# EAGLE board Driver_Board_Niall (EAGLE 9.1.3), part 1 of 2
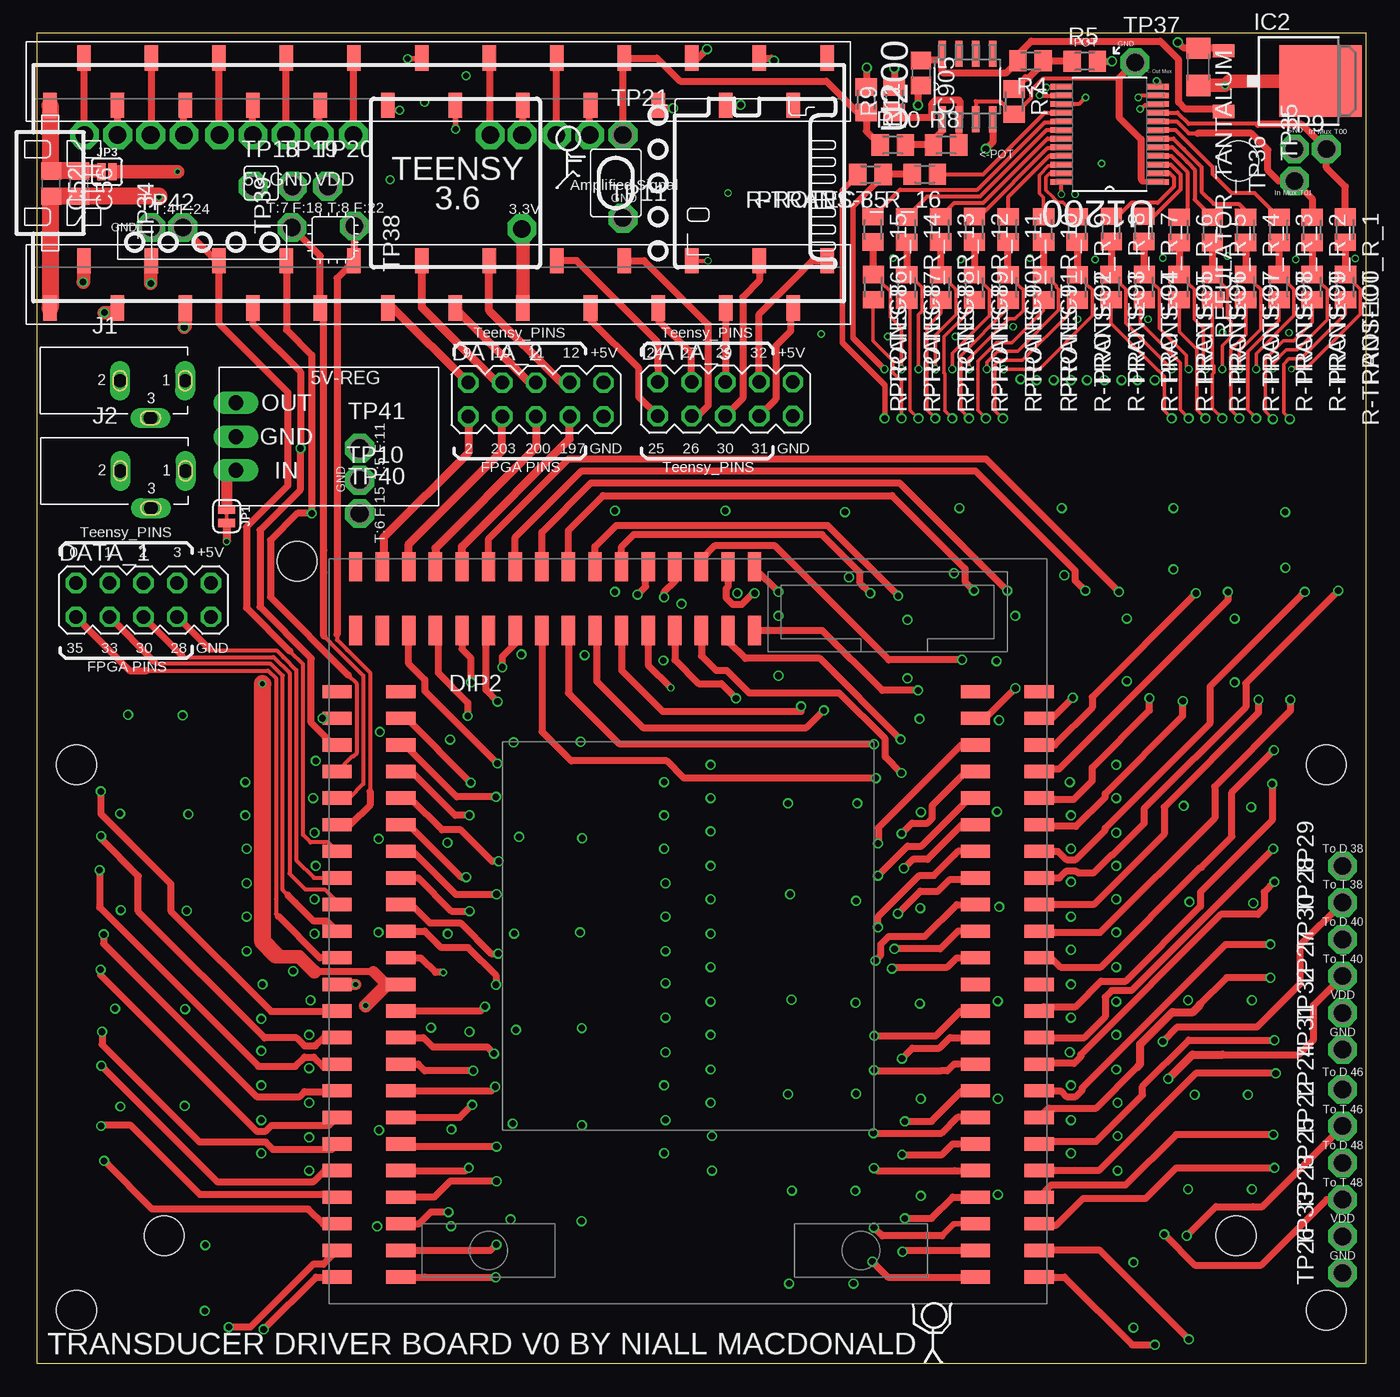
[diagram p5: board, top side]
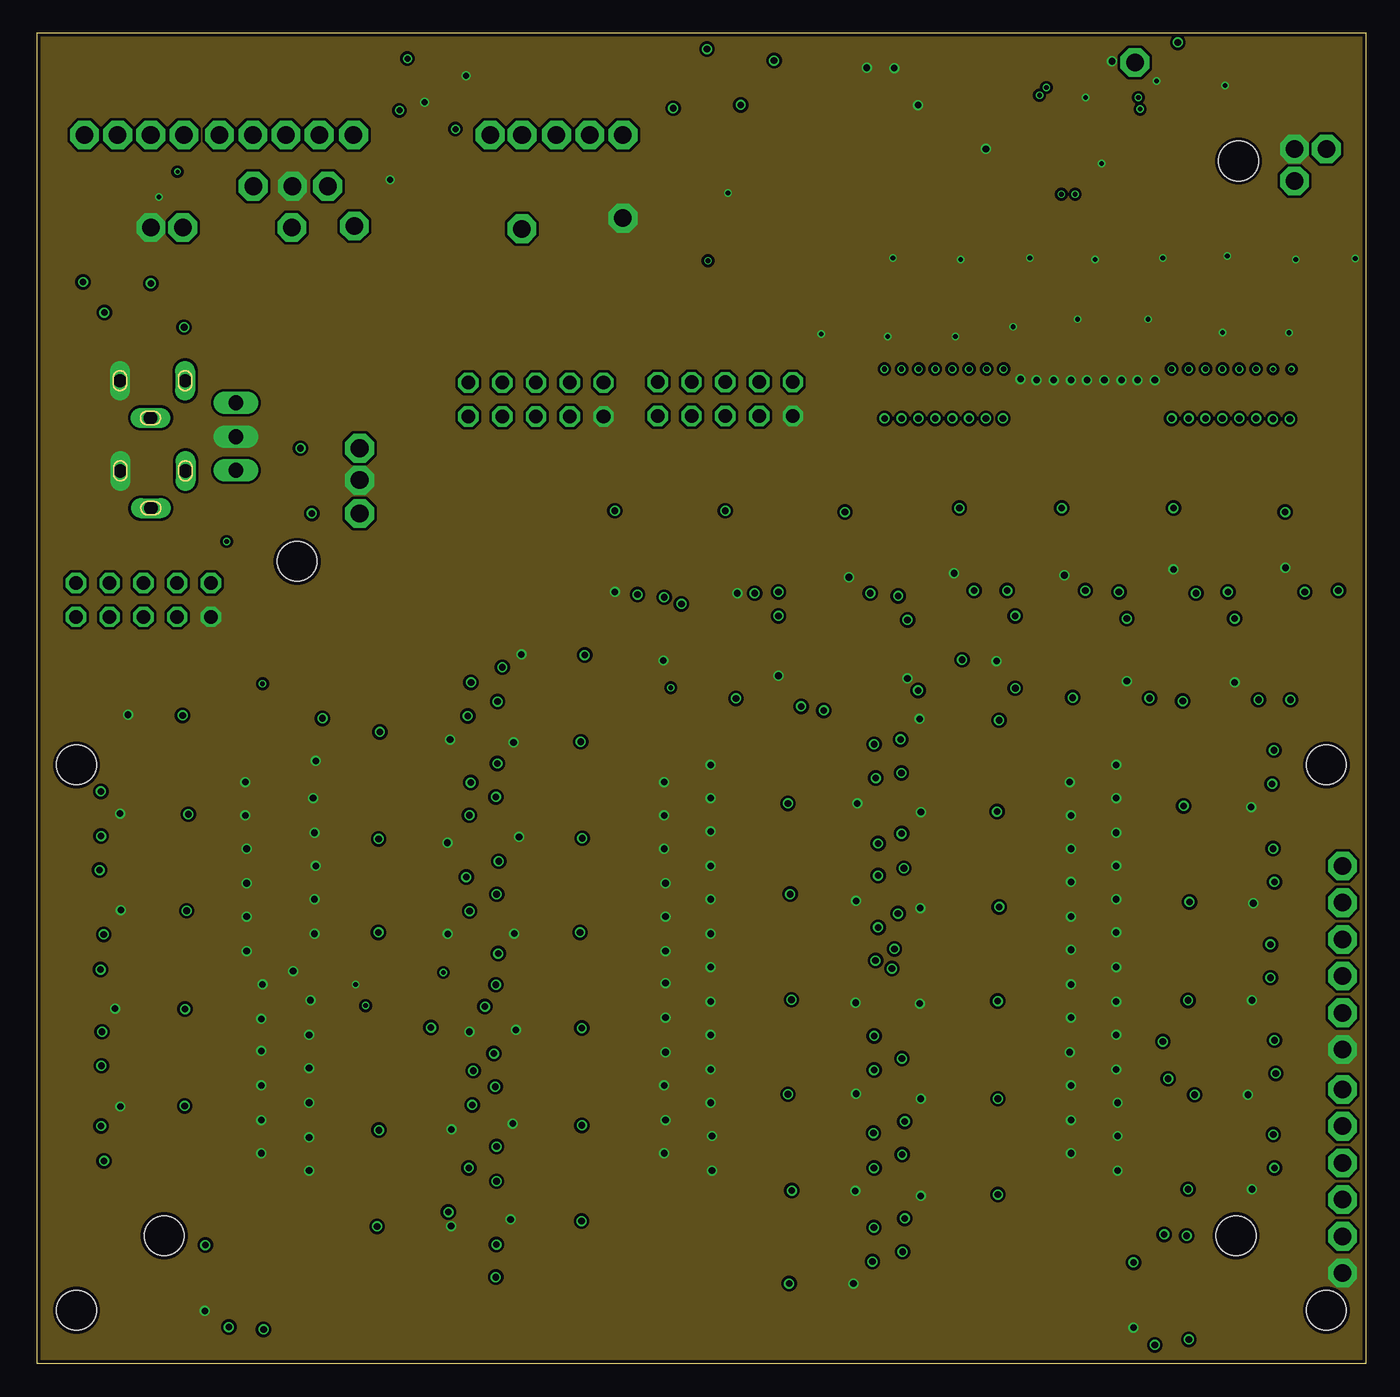
[diagram p6: board, inner layer $GND]
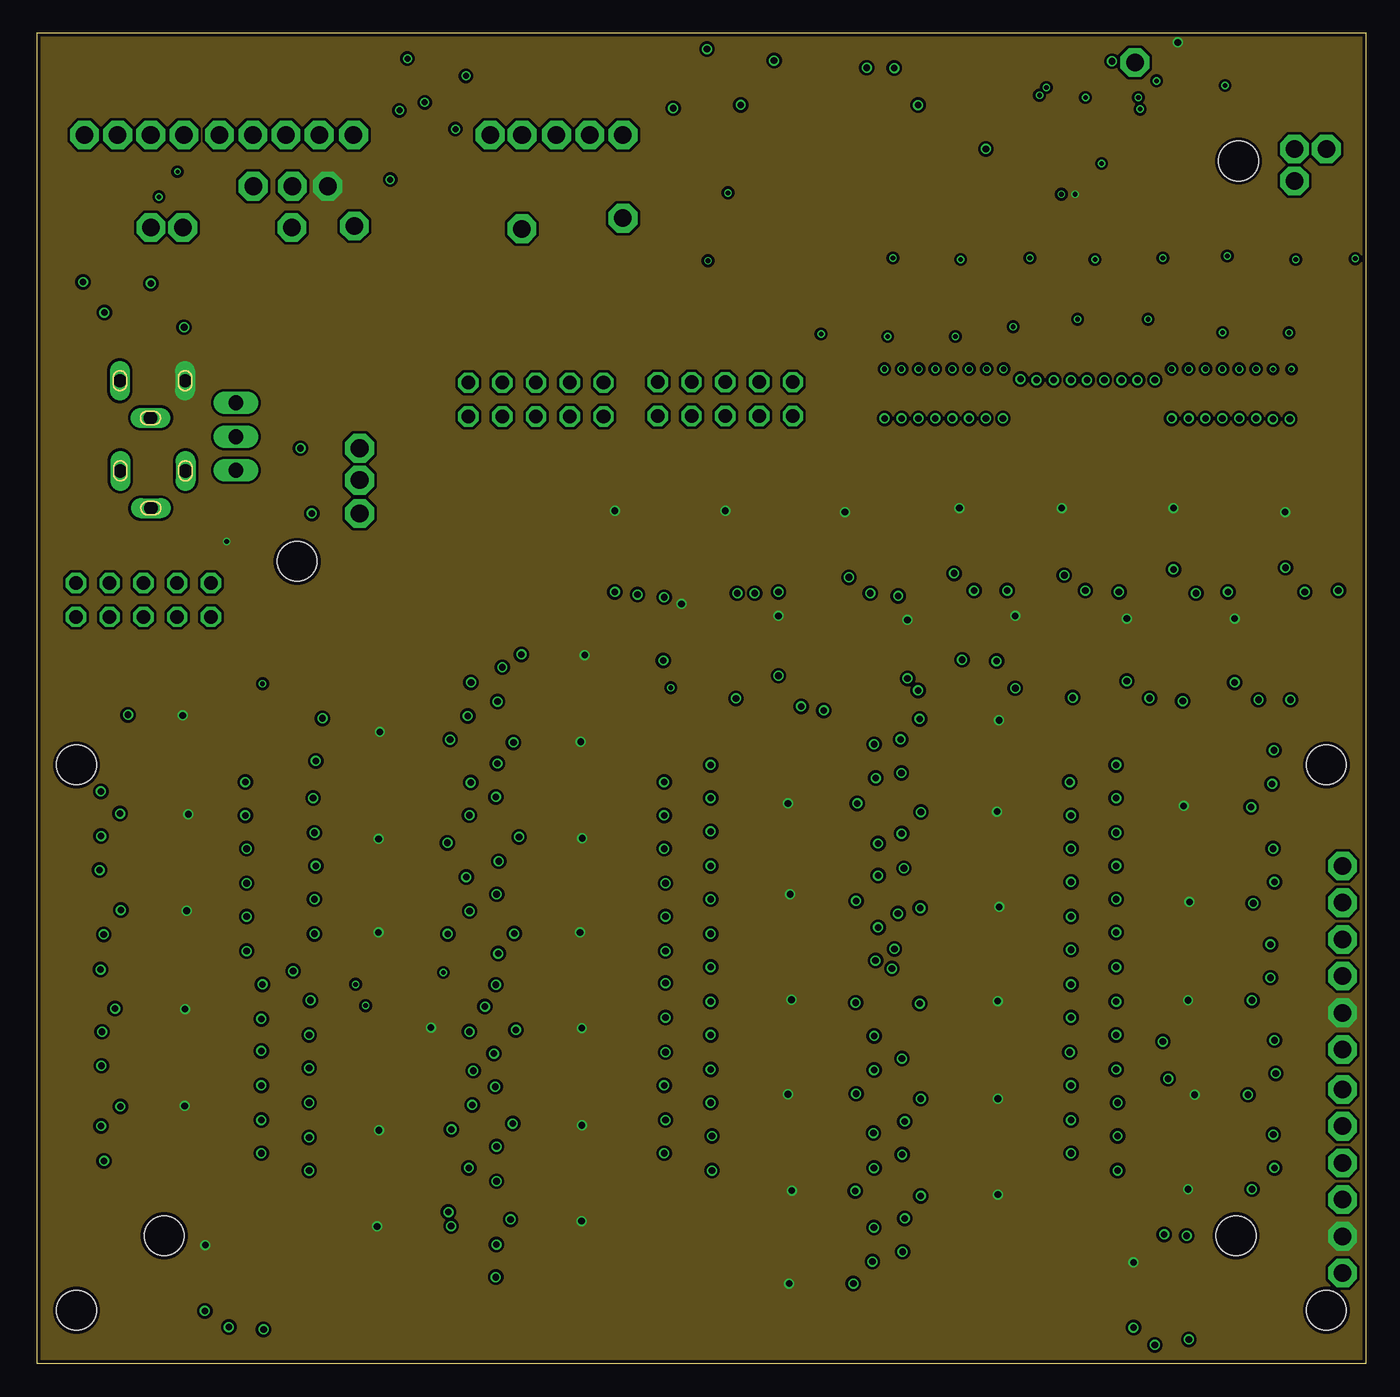
[diagram p7: board, inner layer $VIN]
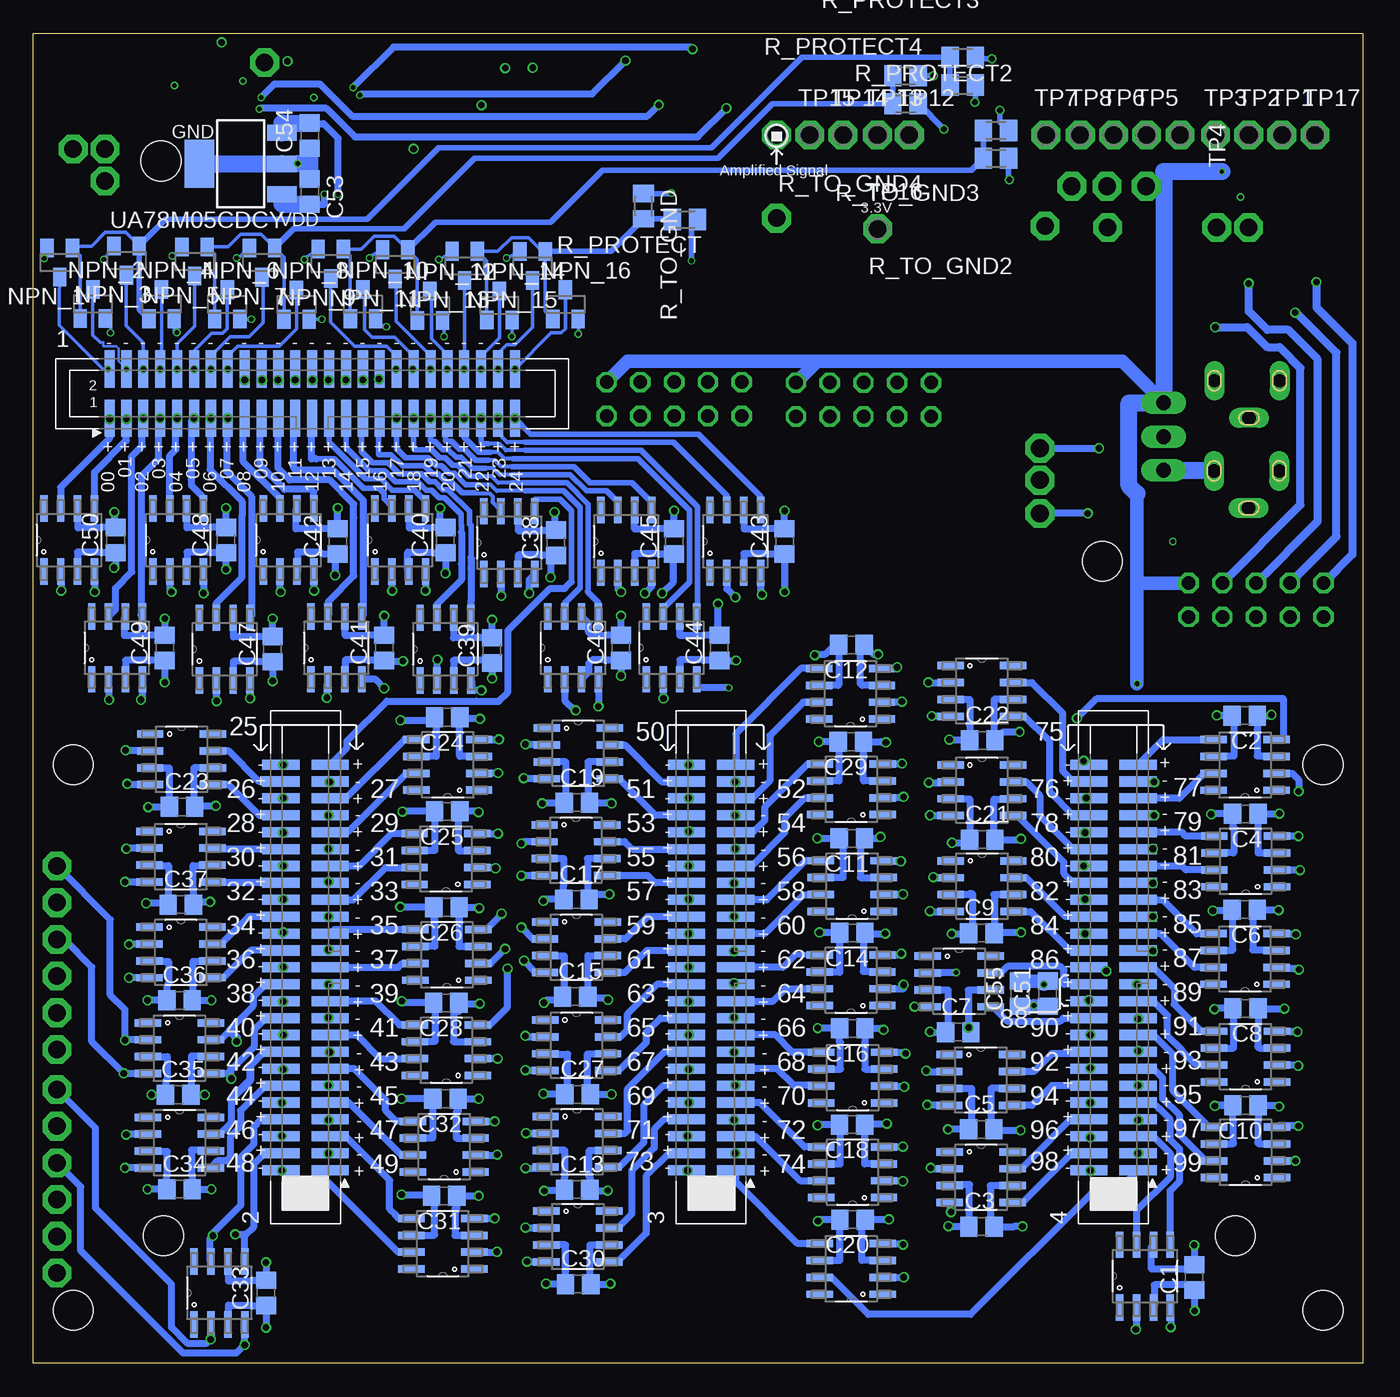
[diagram p8: board, bottom side, seen from below]

Size 100 x 100 mm. Coordinates in mm from the lower left corner, seen from the top.
Outline: 0,0 100,0 100,100 0,100 0,0
Copper layers (1*2*3*16): Top 0.035mm / dielectric 0.2mm / $GND 0.0175mm / dielectric 0.3mm / $VIN 0.035mm / dielectric 0.2mm / Bottom 0.035mm
Design rules "SeeedStudio_4layer_DRU_no_angle_20140221 *": minimum track width 8mil, minimum drill 12mil, track to track 8mil, track to pad 8mil, pad to pad 8mil, via to via 8mil, smd to smd 0mil, copper to edge 10mil, drill to drill 8mil, minimum pad ring 6mil, minimum via ring 4mil, stop-mask expansion 4mil, vias tented up to drill 25mil, thermal gap 10mil
Holes 3 mm at 9.6,9.6 90.2,9.6 90.4,90.4 19.6,60.3 97,4 97,45 3,4 3,45

## Footprints (pad centres in the part's own frame; a part is rotated, then mirrored left to right if it is on the bottom)
PHB_1MM27_2X25_SNS = smd 0.76 x 2.8: 1 -15.24,-1.85; 2 -15.24,1.85; 3 -13.97,-1.85; 4 -13.97,1.85; 5 -12.7,-1.85; 6 -12.7,1.85; 7 -11.43,-1.85; 8 -11.43,1.85; 9 -10.16,-1.85; 10 -10.16,1.85; 11 -8.89,-1.85; 12 -8.89,1.85; 13 -7.62,-1.85; 14 -7.62,1.85; 15 -6.35,-1.85; 16 -6.35,1.85; 17 -5.08,-1.85; 18 -5.08,1.85; 19 -3.81,-1.85; 20 -3.81,1.85; 21 -2.54,-1.85; 22 -2.54,1.85; 23 -1.27,-1.85; 24 -1.27,1.85; 25 0,-1.85; 26 0,1.85; 27 1.27,-1.85; 28 1.27,1.85; 29 2.54,-1.85; 30 2.54,1.85; 31 3.81,-1.85; 32 3.81,1.85; 33 5.08,-1.85; 34 5.08,1.85; 35 6.35,-1.85; 36 6.35,1.85; 37 7.62,-1.85; 38 7.62,1.85; 39 8.89,-1.85; 40 8.89,1.85; 41 10.16,-1.85; 42 10.16,1.85; 43 11.43,-1.85; 44 11.43,1.85; 45 12.7,-1.85; 46 12.7,1.85; 47 13.97,-1.85; 48 13.97,1.85; 49 15.24,-1.85; 50 15.24,1.85
OKI-78SR-HORIZ = drill 1.118 long: GND 0,0; IN 2.54,0; OUT -2.54,0
C0805 = smd 1.3 x 1.5: 1 -0.95,0; 2 0.95,0
MA05-2 = drill 1.016 octagon: 1 -5.08,-1.27; 2 -5.08,1.27; 3 -2.54,-1.27; 4 -2.54,1.27; 5 0,-1.27; 6 0,1.27; 7 2.54,-1.27; 8 2.54,1.27; 9 5.08,-1.27; 10 5.08,1.27
CORE3S500E-SMT = smd 1 x 2.2: 2 -23,28.4; 3 -23,23.6; 4 -25,28.4; 5 -25,23.6; 161 5,28.4; 162 5,23.6; 163 3,28.4; 164 3,23.6; 165 1,28.4; 167 1,23.6; 168 -1,28.4; 171 -1,23.6; 172 -3,28.4; 177 -3,23.6; 178 -5,28.4; 179 -5,23.6; 180 -7,28.4; 181 -7,23.6; 185 -9,28.4; 186 -9,23.6; 187 -11,28.4; 189 -11,23.6; 190 -13,28.4; 192 -13,23.6; 193 -15,28.4; 196 -15,23.6; 197 -17,28.4; 199 -17,23.6; 200 -19,28.4; 202 -19,23.6; 203 -21,28.4; 205 -21,23.6 | smd 2.2 x 1: 3,3V@1 21.6,19; 3,3V@2 -21.6,19; 5V@1 21.6,-3; 5V@2 -21.6,-3; 8 -26.4,17; 9 -21.6,17; 11 -26.4,15; 12 -21.6,15; 15 -26.4,13; 16 -21.6,13; 18 -26.4,11; 19 -21.6,11; 22 -26.4,9; 23 -21.6,9; 24 -26.4,7; 25 -21.6,7; 28 -26.4,5; 29 -21.6,5; 30 -26.4,3; 31 -21.6,3; 33 -26.4,1; 34 -21.6,1; 35 -26.4,-1; 36 -21.6,-1; 39 -26.4,-5; 40 -21.6,-5; 41 -26.4,-7; 42 -21.6,-7; 45 -26.4,-9; 47 -21.6,-9; 48 -26.4,-11; 49 -21.6,-11; 50 -26.4,-13; 55 -21.6,-13; 60 -26.4,-15; 61 -21.6,-15; 62 -26.4,-17; 63 -21.6,-17; 64 -26.4,-19; 65 -21.6,-19; 69 -26.4,-21; 74 -21.6,-21; 75 -26.4,-23; 76 -21.6,-23; 77 -26.4,-25; 82 -21.6,-25; 90 21.6,-25; 93 26.4,-25; 94 21.6,-23; 96 26.4,-23; 97 21.6,-21; 98 26.4,-21; 99 21.6,-19; 100 26.4,-19; 102 21.6,-17; 106 26.4,-17; 107 21.6,-15; 108 26.4,-15; 109 21.6,-13; 112 26.4,-13; 113 21.6,-11; 115 26.4,-11; 116 21.6,-9; 119 26.4,-9; 120 21.6,-7; 122 26.4,-7; 123 21.6,-5; 126 26.4,-5; 127 21.6,-1; 128 26.4,-1; 129 21.6,1; 132 26.4,1; 133 21.6,3; 134 26.4,3; 135 21.6,5; 137 26.4,5; 138 21.6,7; 139 26.4,7; 140 21.6,9; 144 26.4,9; 145 21.6,11; 146 26.4,11; 147 21.6,13; 150 26.4,13; 151 21.6,15; 152 26.4,15; 153 21.6,17; 160 26.4,17; GND@1 26.4,19; GND@2 -26.4,19; GND@3 26.4,-3; GND@4 -26.4,-3
DPACK_3 = smd 1 x 1.6: 1 -2.28,-4.8; 3 2.28,-4.8 | smd 5.4 x 6.2: 4 0,2.5
69410X303002 = drill 1 pad 1.5 long: 1 10.9,0; 2 6,0; 3 8.3,-2.8
SMT-JUMPER_2_NC_TRACE_SILK = smd 0.635 x 1.27: 1 -0.508,0; 2 0.508,0
SMT-JUMPER_2_NO_SILK = smd 0.635 x 1.27: 1 -0.406,0; 2 0.406,0
SOT23 = smd 1 x 1.4: 1 -0.95,-1.1; 2 0.95,-1.1; 3 0,1.1
M0805 = smd 1.3 x 1.6: 1 -0.95,0; 2 0.95,0
C1206 = smd 1.6 x 1.8: 1 -1.4,0; 2 1.4,0
P1-13 = drill 1.321 pad 2.159 octagon: TP 0,0
SOIC127P600X175-8N = smd 1.981 x 0.559: 1 -2.362,1.905; 2 -2.362,0.635; 3 -2.362,-0.635; 4 -2.362,-1.905; 5 2.362,-1.905; 6 2.362,-0.635; 7 2.362,0.635; 8 2.362,1.905
ADA4091-2ARZ-RL_SOIC127P600X175-8N = smd 1.981 x 0.559: 1 -2.464,1.905; 2 -2.464,0.635; 3 -2.464,-0.635; 4 -2.464,-1.905; 5 2.464,-1.905; 6 2.464,-0.635; 7 2.464,0.635; 8 2.464,1.905
SOP65P780X200-24N = smd 1.651 x 0.432: 1 -3.632,3.581; 2 -3.632,2.921; 3 -3.632,2.286; 4 -3.632,1.626; 5 -3.632,0.965; 6 -3.632,0.33; 7 -3.632,-0.33; 8 -3.632,-0.965; 9 -3.632,-1.626; 10 -3.632,-2.286; 11 -3.632,-2.921; 12 -3.632,-3.581; 13 3.632,-3.581; 14 3.632,-2.921; 15 3.632,-2.286; 16 3.632,-1.626; 17 3.632,-0.965; 18 3.632,-0.33; 19 3.632,0.33; 20 3.632,0.965; 21 3.632,1.626; 22 3.632,2.286; 23 3.632,2.921; 24 3.632,3.581
TEENSY_3.6_SMD = smd 1.016 x 1.905: 0/RX3 -26.67,-5.842; 1/TX3 -24.13,-9.398; 2 -21.59,-5.842; 3/CANTX3 -19.05,-9.398; 3V3_LO3 -24.13,5.842; 3V4 6.35,-9.398; 4/CANRX3 -16.51,-5.842; 5 -13.97,-9.398; 6 -11.43,-5.842; 7 -8.89,-9.398; 8 -6.35,-5.842; 9/CS3 -3.81,-9.398; 10/CS3 -1.27,-5.842; 11/MOSI3 1.27,-9.398; 12/MISO3 3.81,-5.842; 13/SCK3 3.81,9.398; 14/A3 1.27,5.842; 15/A4 -1.27,9.398; 16/A4 -3.81,5.842; 17/A4 -6.35,9.398; 18/A4/SDA3 -8.89,5.842; 19/A5/SCL3 -11.43,9.398; 20/A3 -13.97,5.842; 21/A3 -16.51,9.398; 22/A3 -19.05,5.842; 23/A3 -21.59,9.398; 24 8.89,-5.842; 25 11.43,-9.398; 26 13.97,-5.842; 27 16.51,-9.398; 28 19.05,-5.842; 29 21.59,-9.398; 30 24.13,-5.842; 31/A3 26.67,-9.398; 32/A3 29.21,-5.842; 33/A3 29.21,9.398; 34/A3 26.67,5.842; 35/A3 24.13,9.398; 36/A3 21.59,5.842; 37/A3 19.05,9.398; 38/A3 16.51,5.842; 39/A3 13.97,9.398; A21/DAC0 11.43,5.842; A22/DAC1 8.89,9.398; AGND3 -26.67,9.398; GND6 -29.21,-9.398; GND7 6.35,5.842; VIN3 -29.21,5.842
SOT223 = smd 1.219 x 2.235: 1 -2.311,-3.099; 2 0,-3.099; 3 2.311,-3.099 | smd 3.6 x 2.2: 4 0,3.099

## Placement (x,y rotation side)
1  PHB_1MM27_2X25_SNS  [PHB_1MM27_2X25_SNS]  79.02,72.9 0 bottom
2  PHB_1MM27_2X25_SNS  [PHB_1MM27_2X25_SNS]  79.52,29.78 90 bottom
3  PHB_1MM27_2X25_SNS  [PHB_1MM27_2X25_SNS]  49.02,29.78 90 bottom
4  PHB_1MM27_2X25_SNS  [PHB_1MM27_2X25_SNS]  18.77,29.78 90 bottom
5V-REG  OKI-78SR  [OKI-78SR-HORIZ]  14.99,69.67 270 top
C1  100nF  [C0805]  12.7,6.48 90 bottom
C2  100nF  [C0805]  8.89,48.7 180 bottom
C3  100nF  [C0805]  28.68,10.29 0 bottom
C4  100nF  [C0805]  8.85,41.32 180 bottom
C5  100nF  [C0805]  28.71,17.6 0 bottom
C6  100nF  [C0805]  8.9,34.12 180 bottom
C7  100nF  [C0805]  30.44,24.91 0 bottom
C8  100nF  [C0805]  8.83,26.69 180 bottom
C9  100nF  [C0805]  28.7,32.36 0 bottom
C10  100nF  [C0805]  8.84,19.4 180 bottom
C11  100nF  [C0805]  38.45,39.47 180 bottom
C12  100nF  [C0805]  38.47,54.02 180 bottom
C13  100nF  [C0805]  59.09,13.06 0 bottom
C14  100nF  [C0805]  38.4,32.37 180 bottom
C15  100nF  [C0805]  59.24,27.58 0 bottom
C16  100nF  [C0805]  38.41,25.2 180 bottom
C17  100nF  [C0805]  59.15,34.88 0 bottom
C18  100nF  [C0805]  38.41,17.95 180 bottom
C19  100nF  [C0805]  59.11,42.16 0 bottom
C20  100nF  [C0805]  38.39,10.82 180 bottom
C21  100nF  [C0805]  28.63,39.38 0 bottom
C22  100nF  [C0805]  28.63,46.84 0 bottom
C23  100nF  [C0805]  88.81,41.84 0 bottom
C24  100nF  [C0805]  68.87,48.58 180 bottom
C25  100nF  [C0805]  68.87,41.5 180 bottom
C26  100nF  [C0805]  68.93,34.3 180 bottom
C27  100nF  [C0805]  59.07,20.23 0 bottom
C28  100nF  [C0805]  68.94,27.11 180 bottom
C29  100nF  [C0805]  38.51,46.74 180 bottom
C30  100nF  [C0805]  59.02,5.97 0 bottom
C31  100nF  [C0805]  69.1,12.6 180 bottom
C32  100nF  [C0805]  69,19.9 180 bottom
C33  100nF  [C0805]  82.5,5.3 90 bottom
C34  100nF  [C0805]  89,13.1 0 bottom
C35  100nF  [C0805]  89.1,20.2 0 bottom
C36  100nF  [C0805]  89,27.3 0 bottom
C37  100nF  [C0805]  88.9,34.5 0 bottom
C38  100nF  [C0805]  60.7,61.7 90 bottom
C39  100nF  [C0805]  65.5,53.6 90 bottom
C40  100nF  [C0805]  69,61.9 90 bottom
C41  100nF  [C0805]  73.6,53.8 90 bottom
C42  100nF  [C0805]  77.1,61.8 90 bottom
C43  100nF  [C0805]  43.5,61.8 90 bottom
C44  100nF  [C0805]  48.4,53.8 90 bottom
C45  100nF  [C0805]  51.8,61.8 90 bottom
C46  100nF  [C0805]  55.8,53.8 90 bottom
C47  100nF  [C0805]  82,53.7 90 bottom
C48  100nF  [C0805]  85.5,61.9 90 bottom
C49  100nF  [C0805]  90.1,53.8 90 bottom
C50  100nF  [C0805]  93.8,61.9 90 bottom
C51  100nF  [C0805]  23.7,27.8 90 bottom
C52  100nF  [C0805]  1.1,88.7 270 top
C53  330nF  [C0805]  79.2,88.1 270 bottom
C54  100nF  [C0805]  79.2,92.3 90 bottom
C55  100nF  [C0805]  25.8,27.8 90 bottom
C56  100nF  [C0805]  3.2,88.7 270 top
C905  100nF  [C0805]  66.52,97.01 270 top
DATA_1  [MA05-2]  8.04,57.4 0 top
DATA_2  [MA05-2]  37.56,72.46 0 top
DATA_3  [MA05-2]  51.8,72.5 0 top
DIP2  CORE3S500ESMT  [CORE3S500E-SMT]  49,31.5 0 top
IC2  NCV78M05BDTRKG  [DPACK_3]  94.08,96.41 270 top
J1  694102303002  [69410X303002]  0.27,73.88 0 top
J2  694102303002  [69410X303002]  0.3,67.1 0 top
JP1  JUMPER-SMT_2_NC_TRACE_SILK  [SMT-JUMPER_2_NC_TRACE_SILK]  14.3,63.7 270 top
JP3  JUMPER-SMT_2_NO_SILK  [SMT-JUMPER_2_NO_SILK]  5.3,89.6 0 top
NPN_1  2N7002  [SOT23]  98.01,82.77 180 bottom
NPN_2  2N7002  [SOT23]  95.51,79.64 0 bottom
NPN_3  2N7002  [SOT23]  92.98,82.91 180 bottom
NPN_4  2N7002  [SOT23]  90.35,79.64 0 bottom
NPN_5  2N7002  [SOT23]  87.86,82.84 180 bottom
NPN_6  2N7002  [SOT23]  85.41,79.61 0 bottom
NPN_7  2N7002  [SOT23]  82.8,82.76 180 bottom
NPN_8  2N7002  [SOT23]  80.2,79.6 0 bottom
NPN_9  2N7002  [SOT23]  77.62,82.68 180 bottom
NPN_10  2N7002  [SOT23]  75.2,79.64 0 bottom
NPN_11  2N7002  [SOT23]  72.78,82.62 180 bottom
NPN_12  2N7002  [SOT23]  70.17,79.51 0 bottom
NPN_13  2N7002  [SOT23]  67.56,82.52 180 bottom
NPN_14  2N7002  [SOT23]  64.95,79.54 0 bottom
NPN_15  2N7002  [SOT23]  62.45,82.5 180 bottom
NPN_16  2N7002  [SOT23]  59.98,79.62 0 bottom
PROTECT_R_1  100K  [M0805]  98.42,85.23 270 top
PROTECT_R_2  100K  [M0805]  95.93,85.22 270 top
PROTECT_R_3  100K  [M0805]  93.43,85.22 270 top
PROTECT_R_4  100K  [M0805]  90.93,85.22 270 top
PROTECT_R_5  100K  [M0805]  88.43,85.22 270 top
PROTECT_R_6  100K  [M0805]  85.93,85.22 270 top
PROTECT_R_7  100K  [M0805]  83.28,85.3 270 top
PROTECT_R_8  100K  [M0805]  80.82,85.29 270 top
PROTECT_R_9  100K  [M0805]  78.27,85.26 270 top
PROTECT_R_10  100K  [M0805]  75.73,85.26 270 top
PROTECT_R_11  100K  [M0805]  73.06,85.26 270 top
PROTECT_R_12  100K  [M0805]  70.53,85.27 270 top
PROTECT_R_13  100K  [M0805]  67.99,85.25 270 top
PROTECT_R_14  100K  [M0805]  65.45,85.24 270 top
PROTECT_R_15  100K  [M0805]  62.9,85.26 270 top
PROTECT_R_16  100K  [M0805]  66.81,89.4 180 top
R4  8.2k  [M0805]  74.75,97.93 180 top
R5  Not Sure  [M0805]  78.83,97.89 0 top
R7  100K  [M0805]  73.53,94.85 270 top
R8  Not Sure  [M0805]  68.4,91.6 0 top
R9  1K  [M0805]  64.5,95 90 top
R10  1.2k  [M0805]  64.4,91.6 0 top
R11  330  [M0805]  62.4,95 270 top
R-TRANS-85  10k  [M0805]  62.71,89.39 180 top
R-TRANS-86  10k  [M0805]  62.93,80.92 270 top
R-TRANS-87  10k  [M0805]  65.45,80.89 270 top
R-TRANS-88  10k  [M0805]  68,80.89 270 top
R-TRANS-89  10k  [M0805]  70.53,80.89 270 top
R-TRANS-90  10k  [M0805]  73.07,80.89 270 top
R-TRANS-91  10k  [M0805]  75.73,80.9 270 top
R-TRANS-92  10k  [M0805]  78.27,80.89 270 top
R-TRANS-93  10k  [M0805]  80.8,80.92 270 top
R-TRANS-94  10k  [M0805]  83.3,80.92 270 top
R-TRANS-95  10k  [M0805]  85.93,80.92 270 top
R-TRANS-96  10k  [M0805]  88.43,80.92 270 top
R-TRANS-97  10k  [M0805]  90.93,80.92 270 top
R-TRANS-98  10k  [M0805]  93.43,80.92 270 top
R-TRANS-99  10k  [M0805]  95.93,80.92 270 top
R-TRANS-100  10k  [M0805]  98.43,80.92 270 top
R_PROTECT  10  [M0805]  51,86 180 bottom
R_PROTECT2  10  [M0805]  27.6,92.7 180 bottom
R_PROTECT3  10  [M0805]  30.1,98.2 180 bottom
R_PROTECT4  10  [M0805]  34.4,94.7 180 bottom
R_TO_GND  1M  [M0805]  54.1,87 270 bottom
R_TO_GND2  1M  [M0805]  27.6,90.6 180 bottom
R_TO_GND3  1M  [M0805]  30.1,96.1 180 bottom
R_TO_GND4  1M  [M0805]  34.4,96.8 180 bottom
REFULATOR_TANTALUM  0.33 uF  [C1206]  87.38,97.47 270 top
TP1  TPSQPAD1-13  [P1-13]  6.1,92.35 0 bottom
TP2  TPSQPAD1-13  [P1-13]  8.59,92.35 0 bottom
TP3  TPSQPAD1-13  [P1-13]  11.09,92.35 0 bottom
TP4  TPSQPAD1-13  [P1-13]  13.75,92.35 270 bottom
TP5  TPSQPAD1-13  [P1-13]  16.27,92.35 0 bottom
TP6  TPSQPAD1-13  [P1-13]  18.76,92.35 0 bottom
TP7  TPSQPAD1-13  [P1-13]  23.84,92.35 0 bottom
TP8  TPSQPAD1-13  [P1-13]  21.26,92.35 0 bottom
TP9  TPSQPAD1-13  [P1-13]  94.6,91.3 0 top
TP10  TPSQPAD1-13  [P1-13]  24.3,66.4 0 top
TP11  TPSQPAD1-13  [P1-13]  44.1,86.1 0 top
TP12  TPSQPAD1-13  [P1-13]  34.11,92.35 0 bottom
TP13  TPSQPAD1-13  [P1-13]  36.51,92.35 0 bottom
TP14  TPSQPAD1-13  [P1-13]  39.1,92.35 0 bottom
TP15  TPSQPAD1-13  [P1-13]  41.6,92.35 0 bottom
TP16  TPSQPAD1-13  [P1-13]  36.5,85.3 0 bottom
TP17  TPSQPAD1-13  [P1-13]  3.6,92.35 0 bottom
TP18  TPSQPAD1-13  [P1-13]  16.3,88.5 0 top
TP19  TPSQPAD1-13  [P1-13]  19.25,88.5 0 top
TP20  TPSQPAD1-13  [P1-13]  21.9,88.5 0 top
TP21  TPSQPAD1-13  [P1-13]  44.1,92.35 0 top
TP22  TPSQPAD1-13  [P1-13]  98.22,17.84 90 top
TP23  TPSQPAD1-13  [P1-13]  98.22,12.32 90 top
TP24  TPSQPAD1-13  [P1-13]  98.22,20.6 90 top
TP25  TPSQPAD1-13  [P1-13]  98.22,15.08 90 top
TP26  TPSQPAD1-13  [P1-13]  98.22,6.8 90 top
TP27  TPSQPAD1-13  [P1-13]  98.22,29.12 90 top
TP28  TPSQPAD1-13  [P1-13]  98.22,34.64 90 top
TP29  TPSQPAD1-13  [P1-13]  98.22,37.4 90 top
TP30  TPSQPAD1-13  [P1-13]  98.22,31.88 90 top
TP31  TPSQPAD1-13  [P1-13]  98.22,23.6 90 top
TP32  TPSQPAD1-13  [P1-13]  98.22,26.36 90 top
TP33  TPSQPAD1-13  [P1-13]  98.22,9.56 90 top
TP34  TPSQPAD1-13  [P1-13]  11,85.4 90 top
TP35  TPSQPAD1-13  [P1-13]  97,91.3 90 top
TP36  TPSQPAD1-13  [P1-13]  94.6,88.9 90 top
TP37  TPSQPAD1-13  [P1-13]  82.6,97.8 0 top
TP38  TPSQPAD1-13  [P1-13]  23.9,85.5 270 top
TP39  TPSQPAD1-13  [P1-13]  19.2,85.4 90 top
TP40  TPSQPAD1-13  [P1-13]  24.3,63.9 0 top
TP41  TPSQPAD1-13  [P1-13]  24.3,68.8 0 top
TP42  TPSQPAD1-13  [P1-13]  8.6,85.4 0 top
U1  [SOIC127P600X175-8N]  16.4,6.57 90 bottom
U2  [SOIC127P600X175-8N]  8.86,44.99 180 bottom
U3  [SOIC127P600X175-8N]  28.71,14 0 bottom
U4  [SOIC127P600X175-8N]  8.82,37.74 180 bottom
U5  [SOIC127P600X175-8N]  28.74,21.31 0 bottom
U6  [SOIC127P600X175-8N]  8.87,30.41 180 bottom
U7  [SOIC127P600X175-8N]  30.37,28.72 0 bottom
U8  [SOIC127P600X175-8N]  8.83,23.07 180 bottom
U9  [SOIC127P600X175-8N]  28.65,35.88 0 bottom
U10  [SOIC127P600X175-8N]  8.83,15.87 180 bottom
U11  [SOIC127P600X175-8N]  38.42,35.88 180 bottom
U12  [SOIC127P600X175-8N]  38.54,50.34 180 bottom
U13  [SOIC127P600X175-8N]  59.11,16.66 0 bottom
U14  [SOIC127P600X175-8N]  38.5,28.81 180 bottom
U15  [SOIC127P600X175-8N]  59.15,31.29 0 bottom
U16  [SOIC127P600X175-8N]  38.38,21.49 180 bottom
U17  [SOIC127P600X175-8N]  59.18,38.59 0 bottom
U18  [SOIC127P600X175-8N]  38.38,14.37 180 bottom
U19  [SOIC127P600X175-8N]  59.02,45.86 0 bottom
U20  [SOIC127P600X175-8N]  38.48,7.11 180 bottom
U21  [SOIC127P600X175-8N]  28.66,43.09 0 bottom
U22  [SOIC127P600X175-8N]  28.66,50.55 0 bottom
U23  [SOIC127P600X175-8N]  88.85,45.42 0 bottom
U24  [SOIC127P600X175-8N]  68.83,45 180 bottom
U25  [SOIC127P600X175-8N]  68.96,37.92 180 bottom
U26  [SOIC127P600X175-8N]  68.89,30.72 180 bottom
U27  [SOIC127P600X175-8N]  59.14,23.92 0 bottom
U28  [SOIC127P600X175-8N]  68.93,23.55 180 bottom
U29  [SOIC127P600X175-8N]  38.48,43.16 180 bottom
U30  [SOIC127P600X175-8N]  59.05,9.55 0 bottom
U31  [SOIC127P600X175-8N]  69.2,9 180 bottom
U32  [SOIC127P600X175-8N]  69.1,16.3 180 bottom
U33  [SOIC127P600X175-8N]  86,5.3 90 bottom
U34  [SOIC127P600X175-8N]  89,16.6 0 bottom
U35  [SOIC127P600X175-8N]  89,23.7 0 bottom
U36  [SOIC127P600X175-8N]  88.9,30.9 0 bottom
U37  [SOIC127P600X175-8N]  88.9,38.1 0 bottom
U38  [SOIC127P600X175-8N]  64.2,61.7 90 bottom
U39  [SOIC127P600X175-8N]  69,53.7 90 bottom
U40  [SOIC127P600X175-8N]  72.4,61.9 90 bottom
U41  [SOIC127P600X175-8N]  77.2,53.8 90 bottom
U42  [SOIC127P600X175-8N]  80.8,61.9 90 bottom
U43  [SOIC127P600X175-8N]  47.2,61.8 90 bottom
U44  [SOIC127P600X175-8N]  52,53.8 90 bottom
U45  [SOIC127P600X175-8N]  55.4,61.8 90 bottom
U46  [SOIC127P600X175-8N]  59.4,53.8 90 bottom
U47  [SOIC127P600X175-8N]  85.6,53.7 90 bottom
U48  [SOIC127P600X175-8N]  89.1,61.9 90 bottom
U49  [SOIC127P600X175-8N]  93.7,53.8 90 bottom
U50  [SOIC127P600X175-8N]  97.3,61.9 90 bottom
U200  ADA4091-2ARZ-RL  [ADA4091-2ARZ-RL_SOIC127P600X175-8N]  70,96 90 top
U1200  CD74HC4067SM96  [SOP65P780X200-24N]  80.7,92.4 180 top
U$1  TEENSY_SMD  [TEENSY_3.6_SMD]  30.23,88.74 0 top
UA78M05CDCY  [SOT223]  84.4,90.2 90 bottom

## Tracks (layer width: path | path; a pad name or v marks a point on that pad's centre or on a via)
1  (via drill 0.5)
  Top 0.508: DIP2.75 21.56,7.46 20.8,7.46 16.07,2.73 v14.46,2.73
  Bottom 0.508: U1.4 14.46,4.18 v14.46,2.73
2  (via drill 0.5)
  Top 0.508: v17.08,2.56 21.02,6.5 DIP2.77
  Bottom 0.508: U1.2 17.03,2.61 v17.08,2.56
3  (via drill 0.5)
  Top 0.508: DIP2.8 22.5,48.4 22.3,48.4 22.2,48.5 v21.5,48.5
  Bottom 0.508: U2.4 6,46.9 6,50 20,50 v21.5,48.5
4  (via drill 0.5)
  Top 0.508: DIP2.39 22.57,26.47 17.63,26.47 10.1,34 10.1,36.05 4.84,41.31 v4.84,43.01
  Bottom 0.508: U2.2 5.3,44.36 4.84,43.9 v4.84,43.01
5  (via drill 0.5)
  Top 0.508: DIP2.74 28.77,10.5 29.65,11.39 v30.97,11.39
  Bottom 0.508: U3.4 31.08,11.49 v30.97,11.39
6  (via drill 0.5)
  Top 0.508: v32.51,14.7 32.31,14.5 DIP2.63
  Bottom 0.508: v32.51,14.7 32.45,14.64 U3.2
7  (via drill 0.5)
  Top 0.508: v4.85,39.65 4.85,39.45 7.66,36.64 7.66,33.96 17.16,24.47 19.55,24.47 20.16,23.87 20.97,23.87 21.6,24.5 DIP2.41
  Bottom 0.508: U4.4 v4.85,39.65
8  (via drill 0.5)
  Top 0.508: v4.74,37.09 4.74,34.29 16.7,22.33 19.45,22.33 20.16,23.03 20.84,23.03 21.55,22.33 22.43,22.33 DIP2.45
  Bottom 0.508: v4.74,37.09 6.44,37.09 U4.2
9  (via drill 0.5)
  Top 0.508: DIP2.55 31.83,18.5 v32.77,19.44
  Bottom 0.508: v32.77,19.44 31.14,19.44 U5.4
10  (via drill 0.5)
  Top 0.508: v32.85,22 29.2,22 28.7,22.5 DIP2.47
  Bottom 0.508: v32.85,22 32.78,21.94 U5.2
11  (via drill 0.5)
  Top 0.508: v5.05,32.25 5.05,31.57 16.55,20.07 19.79,20.07 20.16,20.43 22.53,20.43 DIP2.48
  Bottom 0.508: U6.4 6.51,32.25 v5.05,32.25
12  (via drill 0.5)
  Top 0.508: v4.82,29.61 4.82,29.19 16.54,17.47 17.25,17.47 17.68,17.9 22,17.9 DIP2.50
  Bottom 0.508: U6.2 6.41,29.68 4.88,29.68 v4.82,29.61
13  (via drill 0.5)
  Top 0.508: DIP2.40 33.4,26.5 v33.73,26.82
  Bottom 0.508: v33.73,26.82 v33.72,26.82 U7.4
14  (via drill 0.35)
  Top 0.508: DIP2.36 28.9,30.5 30,29.4 v30.6,29.4
  Bottom 0.508: v30.6,29.4 arc90 30.64,29.36 U7.2
15  (via drill 0.5)
  Top 0.508: v4.93,24.93 4.93,23.97 12.27,16.63 17.25,16.63 17.78,16.1 22.2,16.1 DIP2.60
  Bottom 0.508: U8.4 5.47,24.97 5.42,24.92 5.41,24.93 v4.93,24.93
16  (via drill 0.5)
  Top 0.508: v4.87,22.38 13.59,13.67 20.84,13.67 20.88,13.7 21.68,14.5 DIP2.62
  Bottom 0.508: v4.87,22.38 4.93,22.43 U8.2
17  (via drill 0.5)
  Top 0.508: v32.57,34.01 31.19,34.01 28.7,36.5 DIP2.29
  Bottom 0.508: v32.57,34.01 32.57,33.98 U9.4
18  (via drill 0.5)
  Top 0.508: v32.31,36.57 31.93,36.57 28,40.5 DIP2.23
  Bottom 0.508: v32.31,36.57 32.26,36.52 U9.2
19  (via drill 0.5)
  Top 0.508: v4.85,17.85 4.9,17.9 7.1,17.9 12.3,12.7 22.4,12.7 DIP2.64
  Bottom 0.508: U10.4 6.39,17.85 v4.85,17.85
20  (via drill 0.5)
  Top 0.508: v5.07,15.22 8.69,11.61 20.43,11.61 21.54,10.5 DIP2.69
  Bottom 0.508: v5.07,15.22 5.09,15.24 U10.2
21  (via drill 0.5)
  Top 0.508: v34.76,37.75 34.26,37.75 31.91,40.11 30.49,40.11 28.1,42.5 DIP2.19
  Bottom 0.508: v34.76,37.75 36.02,37.75 U11.4
22  (via drill 0.5)
  Top 0.508: v34.6,35.27 31.53,35.27 28.3,38.5 DIP2.25
  Bottom 0.508: U11.2 34.62,35.25 v34.6,35.27
23  (via drill 0.5)
  Top 0.508: v35.03,52.34 35.03,53.14 36,54.11 DIP2.192
  Bottom 0.508: U12.4 35.88,52.25 35.83,52.29 35.08,52.29 v35.03,52.34
24  (via drill 0.5)
  Top 0.508: v34.67,49.76 33.8,50.64 33.8,54.9 DIP2.196
  Bottom 0.508: v34.67,49.76 34.73,49.71 U12.2
25  (via drill 0.5)
  Top 0.508: v62.98,14.69 63.17,14.5 69.04,14.5 DIP2.102
  Bottom 0.508: U13.4 61.54,14.69 v62.98,14.69
26  (via drill 0.5)
  Top 0.508: v62.94,17.32 68.08,17.32 69.27,18.5 DIP2.109
  Bottom 0.508: v62.94,17.32 61.49,17.32 U13.2
27  (via drill 0.5)
  Top 0.508: v34.73,30.81 34.2,30.81 31.88,33.13 29.57,33.13 28.2,34.5 DIP2.31
  Bottom 0.508: U14.4 34.73,30.71 v34.73,30.81
28  (via drill 0.5)
  Top 0.508: DIP2.34 29.19,32.5 30.43,31.27 32.45,31.27 34.55,29.17 v34.55,28.47
  Bottom 0.508: U14.2 34.55,28.17 v34.55,28.47
29  (via drill 0.5)
  Top 0.508: v63.09,30.28 63.5,30.69 63.5,31.5 64.1,32.1 66.8,32.1 69.2,34.5 DIP2.133
  Bottom 0.508: U15.4 62.21,29.38 63.09,30.27 v63.09,30.28
30  (via drill 0.5)
  Top 0.508: v63.29,32.78 63.29,33.59 66.4,36.7 67.5,36.7 69.04,38.24 69.3,38.5 DIP2.138
  Bottom 0.508: U15.2 62.44,31.92 v63.29,32.78
31  (via drill 0.5)
  Top 0.508: DIP2.42 29.1,24.5 29.8,23.8 33.9,23.8 v34.4,23.3
  Bottom 0.508: U16.4 34.5,23.4 v34.4,23.3
32  (via drill 0.5)
  Top 0.508: DIP2.49 34.2,20.5 v34.5,20.8
  Bottom 0.508: U16.2 34.56,20.86 v34.5,20.8
33  (via drill 0.5)
  Top 0.508: DIP2.145 70.15,42.5 66.55,38.9 65.51,38.9 65.31,38.7 v63.28,36.68
  Bottom 0.508: U17.4 v63.28,36.68
34  (via drill 0.5)
  Top 0.508: v63.28,39.09 63.3,39.11 63.3,40.26 69.54,46.5 DIP2.151
  Bottom 0.508: U17.2 63.15,39.22 v63.28,39.09
35  (via drill 0.5)
  Top 0.508: DIP2.61 27.6,16.3 v34.6,16.3
  Bottom 0.508: U18.4 34.62,16.28 v34.6,16.3
36  (via drill 0.5)
  Top 0.508: DIP2.65 29.91,12.5 31.11,13.7 v34.6,13.7
  Bottom 0.508: U18.2 34.64,13.74 v34.6,13.7
37  (via drill 0.5)
  Top 0.508: v63.12,44.01 48.69,44.01 47.4,45.3 40.2,45.3 38,47.5 DIP2.189
  Bottom 0.508: U19.4 63.12,43.96 v63.12,44.01
38  (via drill 0.5)
  Top 0.508: v62.99,46.55 43.85,46.55 40,50.4 DIP2.186
  Bottom 0.508: U19.2 62.99,46.5 v62.99,46.55
39  (via drill 0.5)
  Top 0.508: DIP2.76 34.15,8.5 v34.58,8.94
  Bottom 0.508: U20.4 34.66,9.02 v34.58,8.94
40  (via drill 0.5)
  Top 0.508: v34.53,6.49 29.2,6.5 DIP2.82
  Bottom 0.508: U20.2 36.09,6.5 34.54,6.5 v34.53,6.49
41  (via drill 0.5)
  Top 0.508: v32.55,41.21 31.49,41.21 28.2,44.5 DIP2.16
  Bottom 0.508: v32.55,41.21 31.05,41.21 U21.4
42  (via drill 0.5)
  Top 0.508: DIP2.9 27.82,48.5 v32.66,43.66
  Bottom 0.508: v32.66,43.66 31.08,43.66 U21.2
43  (via drill 0.5)
  Top 0.508: v32.44,48.67 32.44,49.67 30.2,51.91 30.2,54.9 DIP2.202
  Bottom 0.508: v32.44,48.67 32.41,48.65 U22.4
44  (via drill 0.5)
  Top 0.508: v32.68,51.2 32.68,53.02 32,53.7 DIP2.199
  Bottom 0.508: v32.68,51.2 32.66,51.19 U22.2
45  (via drill 0.5)
  Top 0.508: v92.92,43.57 92.92,40.82 87.53,35.43 87.53,34.35 81.92,28.74 80.06,28.74 78.14,26.83 75.73,26.83 DIP2.126
  Bottom 0.508: v92.92,43.57 92.86,43.51 U23.4
46  (via drill 0.5)
  Top 0.508: v93.06,46.1 89.9,42.94 89.9,39.6 87.6,37.3 87.52,37.3 80.02,29.8 77,29.8 76.3,30.5 DIP2.128
  Bottom 0.508: v93.06,46.1 91.26,46.1 U23.2
47  (via drill 0.5)
  Top 0.508: v64.98,46.92 58.9,53 53.3,53 52,54.3 DIP2.164
  Bottom 0.508: v64.98,46.92 65,46.91 U24.4
48  (via drill 0.5)
  Top 0.508: v65.04,44.39 63.82,45.61 63.82,46.95 60.38,50.4 53.6,50.4 51.9,52.1 51.1,52.1 50,53.2 DIP2.167
  Bottom 0.508: v65.04,44.39 65.07,44.37 U24.2
49  (via drill 0.5)
  Top 0.508: v65.06,39.83 65.84,40.62 67,40.62 67.01,40.62 67.34,40.95 67.34,41.94 69.9,44.5 DIP2.147
  Bottom 0.508: v65.06,39.83 U25.4
50  (via drill 0.5)
  Top 0.508: v65.23,37.23 65.91,37.9 67,37.9 69.6,40.5 DIP2.140
  Bottom 0.508: U25.2 65.28,37.28 v65.23,37.24 v65.23,37.23
51  (via drill 0.5)
  Top 0.508: v64.78,33.82 66.46,35.5 67.8,35.5 68.7,36.4 70.5,36.4 DIP2.135
  Bottom 0.508: U26.4 65.93,32.62 64.78,33.77 v64.78,33.82
52  (via drill 0.5)
  Top 0.508: v64.52,31.16 67.97,31.16 69.3,32.5 DIP2.129
  Bottom 0.508: v64.52,31.16 65.6,30.08 U26.2
53  (via drill 0.5)
  Top 0.508: v62.99,22.06 63.05,22 68,22 68.5,22 69,22.5 DIP2.116
  Bottom 0.508: v62.99,22.06 62.94,22.01 U27.4
54  (via drill 0.5)
  Top 0.508: v63,24.63 67.63,24.63 69.5,26.5 DIP2.123
  Bottom 0.508: v63,24.63 62.92,24.55 U27.2
55  (via drill 0.5)
  Top 0.508: v64.33,29.68 64.45,29.8 68.5,29.8 69.2,30.5 DIP2.127
  Bottom 0.508: v64.33,29.68 64.33,26.78 65.66,25.46 U28.4
56  (via drill 0.5)
  Top 0.508: v65.08,22.92 65.86,23.7 67.9,23.7 68.7,24.5 DIP2.120
  Bottom 0.508: U28.2 v65.08,22.92
57  (via drill 0.5)
  Top 0.508: v34.66,45.1 29.2,50.56 29.2,51.4 28,52.6 DIP2.205
  Bottom 0.508: v34.66,45.1 34.69,45.07 U29.4
58  (via drill 0.5)
  Top 0.508: v34.55,42.59 31.61,42.59 27.7,46.5 DIP2.12
  Bottom 0.508: v34.55,42.59 34.62,42.53 U29.2
59  (via drill 0.5)
  Top 0.508: v62.87,7.66 64.03,6.5 DIP2.90
  Bottom 0.508: v62.87,7.66 61.43,7.66 U30.4
60  (via drill 0.5)
  Top 0.406: DIP2.97 69,10.5 68.1,9.6
  Top 0.508: v62.98,10.22 63.6,9.6 68.1,9.6
  Bottom 0.508: U30.2 61.41,10.22 v62.98,10.22
61  (via drill 0.5)
  Top 0.508: v65.3,10.9 67.3,10.9 68.9,12.5 DIP2.99
  Bottom 0.508: U31.4 v65.3,10.9
62  (via drill 0.5)
  Top 0.508: v65.13,8.4 65.23,8.5 DIP2.94
  Bottom 0.508: U31.2 65.13,8.37 v65.13,8.4
63  (via drill 0.5)
  Top 0.508: v65.3,18.2 67.3,18.2 69.6,20.5 DIP2.113
  Bottom 0.508: U32.4 v65.3,18.2
64  (via drill 0.5)
  Top 0.508: v65.1,15.7 68.1,15.7 68.9,16.5 DIP2.107
  Bottom 0.508: U32.2 65.1,15.66 v65.1,15.7
65  (via drill 0.5)
  Top 0.508: v84.1,1.4 82.4,1.4 77.3,6.5 DIP2.93
  Bottom 0.508: U33.4 84.13,2.9 84.13,1.43 v84.1,1.4 84.72,0.78 88.73,0.78 96.42,8.47 96.42,13.28 TP25.TP
66  (via drill 0.5)
  Top 0.508: v86.66,1.81 79.97,8.5 DIP2.96
  Bottom 0.508: U33.2 86.66,2.92 v86.66,1.81 86.98,1.49 88.37,1.49 89.6,2.72 89.6,5.96 93.74,10.1 95.31,11.67 95.31,17.69 TP24.TP
67  (via drill 0.5)
  Top 0.508: v93.1,14.7 85.7,14.7 83.4,12.4 78.7,12.4 76.7,10.4 75.5,10.4 DIP2.98
  Bottom 0.508: U34.4 v93.1,14.7
68  (via drill 0.5)
  Top 0.508: v93.01,17.21 v93,17.2 85.7,17.2 81.9,13.4 76.3,13.4 DIP2.100
  Bottom 0.508: U34.2 92.98,17.23 v93.01,17.21
69  (via drill 0.5)
  Top 0.508: v93.2,21.8 87.18,21.8 79.88,14.5 DIP2.106
  Bottom 0.508: U35.4 v93.19,21.8 v93.2,21.8 95.6,24.2 95.6,29.8 97.68,31.88 TP30.TP
70  (via drill 0.5)
  Top 0.508: DIP2.108 75.6,16.7 79.7,16.7 83.17,20.18 83.17,20.82 86.65,24.3 v93.1,24.3
  Bottom 0.508: U35.2 93.06,24.34 v93.1,24.3 93.1,26.6 94.2,27.7 94.2,33.38 TP29.TP
71  (via drill 0.5)
  Top 0.508: v92.8,29 89.5,29 87.5,27 | 82.8,22.3 79.7,19.2 76.1,19.2 DIP2.112 | 82.8,22.3
  Top 0.61: 82.8,22.3 83,22.5 83,24 85.42,26.42 86.97,26.42 87.48,26.93 87.48,26.98 87.5,27
  Bottom 0.508: U36.4 arc-90 U36.4 v92.8,29
72  (via drill 0.5)
  Top 0.508: v92.8,31.5 89.42,31.5 78.91,20.99 | 78.91,20.99 78.63,20.71 | 78.63,20.55 78.63,20.71 | DIP2.115 77,20.5 | 77,20.5 77.02,20.5 | 77,20.5 77.02,20.5 | 77.02,20.5 77.45,20.07 78.14,20.07 78.63,20.55 | 78.63,20.55 78.63,20.71 | 78.63,20.71 78.91,20.99
  Bottom 0.508: U36.2 arc90 91.3,31.5 v92.8,31.5
73  (via drill 0.5)
  Top 0.508: v93.1,36.2 92.33,35.43 92.33,34.26 91.84,33.77 89.07,33.77 78.53,23.23 78.53,23.05 78.05,22.57 75.47,22.57 DIP2.119
  Bottom 0.508: v93.1,36.2 U37.4
74  (via drill 0.5)
  Top 0.508: v93,38.7 82.33,28.03 80.86,28.03 80.37,27.55 80.37,26.07 78.8,24.5 DIP2.122
  Bottom 0.508: v93,38.7 92.89,38.73 U37.2
75  (via drill 0.5)
  Top 0.508: v62.7,57.9 61.93,58.67 61.93,59.45 59.08,62.3 44.9,62.3 44,61.4 DIP2.178
  Bottom 0.508: U38.4 62.7,58.93 v62.7,57.9
76  (via drill 0.5)
  Top 0.508: v64.8,57.7 59.55,62.95 | 59.55,62.95 59.49,63.01 | DIP2.180 42,61.4 43.61,63.01 59.49,63.01 | 59.49,63.01 59.55,62.95
  Bottom 0.508: U38.2 64.83,57.73 v64.8,57.7
77  (via drill 0.5)
  Top 0.508: v66.3,50.6 63.6,50.6 59.1,55.1 DIP2.162
  Bottom 0.508: U39.4 67.03,51.27 67.03,50.9 67.1,50.9 66.8,50.6 v66.3,50.6
78  (via drill 0.5)
  Top 0.508: v69.6,52.9 64.1,52.9 55.54,61.46 51,61.46 50,60.46 DIP2.165
  Bottom 0.508: v69.6,52.9 69.64,52.87 U39.2
79  (via drill 0.5)
  Top 0.508: v70.5,58.1 69.83,58.77 69.83,59.74 64.34,65.23 42.6,65.23 40,62.63 DIP2.185
  Bottom 0.508: U40.4 v70.5,58.1
80  (via drill 0.5)
  Top 0.508: v73,58.1 64.9,66.2 41.7,66.2 38,62.5 DIP2.187
  Bottom 0.508: U40.2 73.03,58.13 v73,58.1
81  (via drill 0.5)
  Top 0.508: v73.61,50.76 71.35,48.5 DIP2.153
  Bottom 0.508: v73.61,50.76 74.31,51.46 75.27,51.46 U41.4
82  (via drill 0.5)
  Top 0.508: DIP2.160 76.38,48.5 v77.93,50.05
  Bottom 0.508: v77.93,50.05 77.93,51.03 77.83,51.13 U41.2
83  (via drill 0.5)
  Top 0.508: v78.88,58.1 78.12,58.85 78.12,59.6 70.62,67.1 41,67.1 36,62.1 DIP2.190
  Bottom 0.508: v78.88,58.1 78.89,58.12 U42.4
84  (via drill 0.5)
  Top 0.508: v81.4,58 71.4,68 40,68 34,62 DIP2.193
  Bottom 0.508: v81.4,58 81.44,58.03 U42.2
85  (via drill 0.5)
  Top 0.508: v45.2,57.8 45.8,58.4 45.8,59.7 DIP2.172
  Bottom 0.508: U43.4 45.3,57.9 v45.2,57.8
86  (via drill 0.5)
  Top 0.508: v47.2,57.6 47.2,58 48,58.8 DIP2.168
  Bottom 0.508: U43.2 47.84,58.23 v47.2,57.6
87  (via drill 0.35)
  Top 0.508: DIP2.177 46,52.5 v47.7,50.8
  Bottom 0.508: U44.4 50.09,50.8 v47.7,50.8
88  (via drill 0.5)
  Top 0.508: v52.6,50 51.5,51.1 49.8,51.1 48,52.9 DIP2.171
  Bottom 0.508: U44.2 52.63,50.03 v52.6,50
89  (via drill 0.5)
  Top 0.508: DIP2.163 52,58.38 51.87,58.24 51.87,57.55 52.35,57.07 53.05,57.07 53.88,57.9 v54,57.9
  Bottom 0.508: U45.4 53.49,58.41 v54,57.9
90  (via drill 0.5)
  Top 0.508: DIP2.161 54,59.8 v55.8,58
  Bottom 0.508: U45.2 56.03,58.23 v55.8,58
91  (via drill 0.5)
  Top 0.508: v57.5,49.4 57.5,49 47.1,49 44,52.1 DIP2.179
  Bottom 0.508: U46.4 v57.49,49.41 v57.5,49.4
92  (via drill 0.5)
  Top 0.508: v59.2,49.1 57.9,47.8 45.6,47.8 42.15,51.25 42.15,54.95 DIP2.181
  Bottom 0.508: U46.2 60.03,49.84 59.3,49.1 v59.2,49.1
93  (via drill 0.5)
  Top 0.508: v83.7,50.01 83.7,49.1 79.4,44.8 79.4,43.8 78,42.4 75.5,42.4 DIP2.146
  Bottom 0.508: v83.7,50.01 v83.69,50.02 U47.4
94  (via drill 0.5)
  Top 0.508: DIP2.144 75.8,40.5 75.93,40.37 78.17,40.37 80.37,42.57 80.37,42.84 86.2,48.68 v86.2,49.8
  Bottom 0.508: U47.2 86.23,49.84 v86.2,49.8
95  (via drill 0.5)
  Top 0.508: v87.2,57.9 79.4,50.1 79.4,49.3 76.6,46.5 DIP2.152
  Bottom 0.508: v87.2,57.9 U48.4
96  (via drill 0.5)
  Top 0.508: v89.6,58 89.6,57.38 76.92,44.7 75.6,44.7 DIP2.150
  Bottom 0.508: U48.2 89.73,58.13 v89.6,58
97  (via drill 0.5)
  Top 0.508: v91.9,49.9 91.9,48.92 84.8,41.82 84.8,39.8 79.5,34.5 DIP2.134
  Bottom 0.508: U49.4 91.8,50.01 v91.9,49.9
98  (via drill 0.5)
  Top 0.508: v94.3,49.9 94.3,49.07 88.6,43.37 88.6,41 80,32.4 75.5,32.4 DIP2.132
  Bottom 0.508: U49.2 94.33,49.94 v94.3,49.9
99  (via drill 0.5)
  Top 0.508: v95.38,58.01 88.27,50.9 88.27,48.15 80.37,40.24 80.37,40.09 78.14,37.87 77.45,37.87 76.82,38.5 DIP2.139
  Bottom 0.508: U50.4 95.39,58.02 v95.38,58.01
100  (via drill 0.5)
  Top 0.508: v97.9,58.1 90.93,51.13 90.93,49.33 83.29,41.69 83.29,40.59 80.93,38.23 80.86,38.23 79.52,36.9 78.28,36.9 78.14,37.03 77.45,37.03 76.92,36.5 DIP2.137
  Bottom 0.508: U50.2 97.9,59.54 v97.9,58.1
+5V  (via drill 0.3, 0.35)
  Top 0.203: JP3.2 5.96,89.6
  Top 0.508: 25.34,29.46 21.05,29.46
  Top 0.61: 21.05,29.46 20.9,29.46
  Top 0.813: DIP2.5V@2 26.3,28.5 25.34,29.46
  Top 1.016: DIP2.5V@2 26.35,28.5 v24.75,26.9 | 18,30.7 18.11,30.59 19.75,30.59 20.88,29.46 20.9,29.46 | 5.96,89.6 v10.6,89.6
  Top 1.27: 18,30.7 17.01,31.69 17.01,51.09 v17,51.1
  Bottom 0.203: 15.09,88.5 14.99,88.4
  Bottom 0.508: TP18.TP 15.09,88.5
  Bottom 1.016: C51.1 24.7,26.85 arc90 v24.75,26.9 arc90 24.8,26.85 C55.1 | 41.03,75.33 DATA_2.10 | 41.03,75.33 55.31,75.33 DATA_3.10 | 5V-REG.OUT 18.11,75.33 41.03,75.33 | v17,51.1 17,58.7 | 17,58.7 17,65.4 | DATA_1.10 16.97,58.67 17,58.7
  Bottom 1.27: v10.6,89.6 14.99,89.6 14.99,88.4 5V-REG.OUT 17.6,72.22 17.6,66 17,65.4
+12V
  Top 0.508: 68.09,97.96 C905.1 | 68.09,97.96 U200.8 | IC2.3 89.28,94.3 86.4,94.3 85.9,94.8 85.9,98 84.5,99.4 74.8,99.4 73.8,98.4 R4.2 72.89,97.01 68.19,97.01 68.09,97.11 68.09,97.96
FET_2  (via drill 0.45)
  Top 0.406: U$1.16/A4 26.81,94.2 v27.3,94.2
  Bottom 0.406: v27.3,94.2 27.3,93.35 R_PROTECT2.1
FET_3  (via drill 0.45)
  Top 0.406: U$1.15/A4 28.93,98.1 v27.9,98.1
  Bottom 0.406: v27.9,98.1 29.05,98.1 R_PROTECT3.1
FET_4  (via drill 0.45)
  Top 0.406: U$1.14/A3 v31.5,92.8
  Bottom 0.406: v31.5,92.8 33.4,94.7 R_PROTECT4.1
FPGA_1
  Top 0.305: 8.3,52.09 17.41,52.09 18,51.5 18,34.9 18,33.8 18.2,33.6 20.15,31.65 | 20.15,31.65 21.3,30.5 DIP2.35 | 20.15,31.65
  Top 0.508: DATA_1.1 6.99,52.09 8.3,52.09 | DIP2.35 21.3,30.5 18.2,33.6
FPGA_2
  Top 0.305: 8.86,52.76 9.03,52.6 17.62,52.6 18.51,51.71 18.51,35.59 18.9,35.2
  Top 0.508: 8.86,52.76 DATA_1.3 | 18.9,35.2 19.45,34.65 20.85,33.25 21.85,33.25 DIP2.33
FPGA_3
  Top 0.305: 10.93,53.23 11.06,53.11 17.83,53.11 19.02,51.92 19.02,36.83 20.2,35.64 20.6,35.64 21.68,35.64 22.6,34.72 DIP2.30
  Top 0.508: DATA_1.5 10.93,53.23
FPGA_4
  Top 0.305: 12.9,53.8 13.09,53.62 18.04,53.62 18.58,53.08 19.53,52.13 19.53,37.84 20.87,36.5 DIP2.28
  Top 0.508: DATA_1.7 12.9,53.8
FPGA_10
  Top 0.61: DIP2.197 32,61.4 40.1,69.5 DATA_2.7
FPGA_11
  Top 0.61: DATA_2.5 37.56,68.86 30,61.3 DIP2.200
FPGA_12
  Top 0.61: DIP2.203 28,61.6 35.02,68.62 DATA_2.3
FPGA_13
  Top 0.61: DATA_2.1 32.48,68.48 26.1,62.1 26.1,60 DIP2.2
FROM_TRANS_85  (via drill 0.4)
  Top 0.406: v63.77,74.75 63.75,74.75 61.4,77.1 61.4,87 63.66,89.26 R-TRANS-85.1
  Top 0.508: R-TRANS-85.1 65.84,89.39 PROTECT_R_16.2
  Bottom 0.254: NPN_16.3 59.98,77.8 60.29,77.49 61.05,77.49 1.50 v63.77,74.75
FROM_TRANS_86  (via drill 0.4)
  Top 0.254: R-TRANS-86.1 63.85,80.95 63.87,80.95 64.2,80.61 64.2,78.67 65.05,77.82 1.48
  Top 0.508: PROTECT_R_15.2 62.9,81.9 R-TRANS-86.1
  Bottom 0.254: 1.48 65.05,75.95 64.4,76.6 63.76,76.6 62.45,77.9 NPN_15.3
  other vias: 65.05,74.75
FROM_TRANS_87  (via drill 0.4)
  Top 0.254: R-TRANS-87.1 65.66,81.84 66.6,80.9 66.6,79.1 66.33,78.83 v66.33,74.75
  Top 0.508: PROTECT_R_14.2 R-TRANS-87.1
  Bottom 0.254: NPN_14.3 64.95,77.1 66.15,75.9 66.3,75.9 66.3,74.77 1.46 v66.33,74.75
FROM_TRANS_88  (via drill 0.4)
  Top 0.254: R-TRANS-88.1 68.06,81.84 69.1,80.8 69.1,80.76 69.13,80.73 69.13,78.83 67.59,77.3 1.44
  Top 0.508: PROTECT_R_13.2 67.99,81.91 68.06,81.84
  Bottom 0.254: NPN_13.3 67.56,74.79 1.44
  other vias: 67.6,74.75
FROM_TRANS_89  (via drill 0.4)
  Top 0.254: 1.42 68.86,75.96 71.67,78.77 71.67,80.73 71.47,80.92 71.45,80.92 R-TRANS-89.1
  Top 0.508: PROTECT_R_12.2 70.53,84.31 R-TRANS-89.1
  Bottom 0.254: 1.42 68.86,75.86 70.05,77.05 70.05,80.49 NPN_12.3
  other vias: 68.86,74.75
FROM_TRANS_90  (via drill 0.4)
  Top 0.254: R-TRANS-90.1 73.99,80.92 74,80.92 74.2,80.73 74.2,79.16 73.58,78.54 73.14,78.54 70.13,75.53 1.40
  Top 0.508: R-TRANS-90.1 73.06,81.85 PROTECT_R_11.2
  Bottom 0.254: NPN_11.3 72.72,81.47 72.72,78.35 70.13,75.76 1.40 | 1.40 | 1.40
  other vias: 70.13,74.75
FROM_TRANS_91  (via drill 0.4)
  Top 0.254: R-TRANS-91.1 75.85,81.85 76.7,81 76.7,80.9 76.86,80.74 76.86,79.17 73.79,76.09 72.29,76.09 71.45,75.26 v71.45,74.75
  Top 0.508: PROTECT_R_10.2 R-TRANS-91.1
  Bottom 0.254: NPN_10.3 75.08,80.62 75.08,77.7 74.52,77.14 72.81,77.14 71.4,75.73 1.38 v71.45,74.75
FROM_TRANS_92  (via drill 0.4)
  Top 0.254: R-TRANS-92.1 79.19,80.92 79.21,80.92 79.4,80.73 79.4,78.75 75.41,74.75 v72.72,74.75
  Top 0.508: PROTECT_R_9.2 78.27,81.85 R-TRANS-92.1
  Bottom 0.254: NPN_9.3 77.62,78.28 75.83,76.48 73.42,76.48 72.67,75.73 1.36 v72.72,74.75 | v72.72,74.75
FROM_TRANS_93  (via drill 0.4)
  Top 0.254: R-TRANS-93.1 80.83,81.83 81.72,80.95 81.74,80.95 81.93,80.75 81.93,78.19 1.16
  Top 0.508: PROTECT_R_8.2 80.82,81.85 80.83,81.83
  Bottom 0.254: NPN_8.3 80.2,77.78 81.5,76.48 84.62,76.48 85.37,75.73 1.16
  other vias: 85.37,74.75
FROM_TRANS_94  (via drill 0.4)
  Top 0.254: 1.14 86.46,74.93 86.46,75.8 84.43,77.83 84.43,80.75 84.24,80.95 84.22,80.95 R-TRANS-94.1
  Top 0.508: PROTECT_R_7.2 83.28,81.89 R-TRANS-94.1
  Bottom 0.254: NPN_7.3 82.7,81.56 82.7,78.24 83.75,77.19 85.18,77.19 86.64,75.73 1.14
  other vias: 86.64,74.75
FROM_TRANS_95  (via drill 0.4)
  Top 0.254: 1.12 87.73,74.93 87.73,77.83 87.06,78.49 87.06,80.75 86.87,80.95 86.85,80.95 R-TRANS-95.1
  Top 0.508: PROTECT_R_6.2 R-TRANS-95.1
  Bottom 0.254: NPN_6.3 85.41,77.8 85.75,77.45 86.59,77.45 87.91,76.13 1.12
  other vias: 87.91,74.75
FROM_TRANS_96  (via drill 0.4)
  Top 0.254: R-TRANS-96.1 89.35,80.95 89.37,80.95 89.56,80.75 89.56,78.6 89.81,78.35 89.81,77.15 89.18,76.52 1.10
  Top 0.508: PROTECT_R_5.2 R-TRANS-96.1
  Bottom 0.254: NPN_5.3 87.87,81.73 87.87,77.97 89.18,76.66 1.10
  other vias: 89.18,74.75
FROM_TRANS_97  (via drill 0.4)
  Top 0.254: R-TRANS-97.1 91.85,80.95 91.87,80.95 92.06,80.75 92.06,77.76 90.45,76.15 1.8
  Top 0.508: PROTECT_R_4.2 R-TRANS-97.1
  Bottom 0.254: NPN_4.3 90.35,74.85 1.8
  other vias: 90.45,74.75
FROM_TRANS_98  (via drill 0.4)
  Top 0.254: R-TRANS-98.1 94.35,80.95 94.37,80.95 94.56,80.75 94.56,78.76 91.72,75.92 1.6
  Top 0.508: PROTECT_R_3.2 R-TRANS-98.1
  Bottom 0.254: 1.6 91.72,76.72 93,78 93,81.79 NPN_3.3
  other vias: 91.72,74.75
FROM_TRANS_99  (via drill 0.3)
  Top 0.254: R-TRANS-99.1 96.85,80.95 96.87,80.95 97.06,80.75 97.06,78.46 94.81,76.2 94,76.2 92.96,75.16 92.96,74.78 1.4
  Top 0.508: PROTECT_R_2.2 R-TRANS-99.1
  Bottom 0.203: 1.4 93.58,75.34 93.58,76.28 93.75,76.46 94.69,76.46 94.74,76.5 94.74,76.78 94.98,76.78
  Bottom 0.254: 94.98,76.78 95.51,77.31 NPN_2.3
  other vias: 92.99,74.75
FROM_TRANS_100  (via drill 0.3)
  Top 0.254: R-TRANS-100.1 99.35,80.95 99.37,80.95 99.56,80.75 99.56,78.88 95.53,74.85 94.48,74.85 arc90 v94.38,74.75
  Top 0.508: PROTECT_R_1.2 R-TRANS-100.1
  Bottom 0.254: NPN_1.3 98.05,80.06 98.05,78.05 94.75,74.75 v94.38,74.75 1.2
GND  (via drill 0.35, 0.45, 0.5)
  Top 0.305: v78.88,95.18 78.38,94.68 78.38,94.69 U1200.15 | 84.33,96.32 U1200.12
  Top 0.508: v62.44,97.41 62.4,97.37 R11.1 | v64.5,97.38 R9.2 | v66.3,94.6 66.3,95.84 C905.2 | U200.4 71.91,91.81 v71.4,91.3 | R5.2 79.79,97.9 v80.89,97.9 | 84.33,96.32 v84.23,96.42
  Top 0.813: DIP2.GND@4 v24,28.5
  Top 1.016: IC2.4 89.71,96.41 v89.38,96.07 REFULATOR_TANTALUM.2
  Top 1.27: v9.2,87.7 9.2,87.75 C56.2 C52.2 1.02,87.67 U$1.GND6
  Bottom 0.203: NPN_1.2 98.96,83.27 v99.17,83.06
  Bottom 0.254: NPN_16.2 59.03,78.03 59,78 v59,77.4 | NPN_14.2 64,77.2 v64,77.2 v64.01,77.21 | NPN_12.2 69.1,78.3 v69.1,77.2 | v73.44,77.94 73.65,77.94 NPN_10.2 | NPN_8.2 v78.3,78.5 | NPN_6.2 v83.6,78.5 | NPN_4.2 89.4,77.5 v89.2,77.5 | v94.7,83 94.7,83.04 93.93,83.81 NPN_3.2 | NPN_5.2 v89.55,83.25 | NPN_7.2 84.6,83.1 v84.7,83.1 | NPN_9.2 79.7,83 v79.6,83 | NPN_11.2 74.7,83.2 v74.7,83.1 | NPN_13.2 69.3,83.1 v69.5,83 | NPN_15.2 64.35,83.07 v64.4,83.1 | NPN_2.2 94.19,78.17 v94.19,77.48 | 1.32 v75.2,73.93 | 1.30 76.48,73.95 v76.5,73.93 | 1.28 77.75,73.93 v77.8,73.93 | 1.26 79.02,73.95 v79,73.93 | 1.22 81.56,73.97 v81.6,73.93 | 1.20 82.83,73.96 v82.8,73.93 | 1.18 v84.1,73.93 | 1.34 74.04,74.65 74.04,74.04 v74,74 | 1.24 v80.29,73.93 v80.3,73.93
  Bottom 0.305: 52.05,87.95 arc-90 v52,88 | 93.98,59.82 v93.92,59.82 | 3.7 47.22,18.3 v47.3,18.3 | 3.3 v47.2,15.8 | 3.2 50.84,14.54 v50.8,14.5 | 3.6 50.82,17.08 v50.8,17.1 | 3.10 50.72,19.62 v50.7,19.6 | 3.14 50.76,22.16 v50.7,22.1 | 3.15 47.27,23.43 v47.3,23.4 | 3.18 v50.7,24.7 | 3.22 50.74,27.24 v50.7,27.2 | 3.23 47.21,28.51 v47.3,28.6 | 3.26 50.72,29.78 v50.7,29.8 | 3.27 47.95,31.05 48,31 v47.3,31 | 3.30 50.72,32.32 v50.7,32.3 | 3.31 47.29,33.59 v47.3,33.6 | 3.34 50.74,34.86 v50.7,34.9 | 3.35 47.27,36.13 v47.3,36.1 | 3.38 v50.7,37.4 | 3.39 v47.2,38.7 | 3.42 50.81,40 v50.7,40 | 3.43 v47.2,41.2 | 3.46 50.72,42.48 v50.7,42.5 | 3.47 47.2,43.72 v47.2,43.7 | 3.50 50.85,45 v50.7,45
  Bottom 0.406: R_TO_GND.1 52.05,87.95 | R_TO_GND2.1 26.65,89.05 v26.6,89 | R_TO_GND3.1 29.15,94.85 v29.2,94.8 | R_TO_GND4.1 v32.3,96.8
  Bottom 0.508: U50.3 96.67,60.99 94.93,60.99 94.89,60.95 C50.1 93.8,60 93.98,59.82 | v85.5,59.7 C48.1 86.69,60.95 86.73,60.99 88.43,60.99 88.43,59.57 U48.3 | v82,51.3 C47.1 83.19,52.75 83.23,52.79 84.97,52.79 U47.3 | U46.3 58.23,51.97 58.23,52.62 57.96,52.89 57.03,52.89 56.99,52.85 C46.1 v55.8,51.7 | U44.3 51.37,52.89 49.63,52.89 49.59,52.85 C44.1 v47.15,52.85 | v43.5,58 C43.1 44.79,60.85 44.83,60.89 46.56,60.89 U43.3 | v77.29,59.25 77.29,60.66 C42.1 78.29,60.85 78.43,60.99 80.13,60.99 80.13,59.57 U42.3 | U41.3 76.53,51.47 76.53,52.89 74.83,52.89 74.79,52.85 C41.1 73.55,52.8 v72.2,52.8 | v69,59.4 C40.1 69.99,60.95 70.03,60.99 71.83,60.99 71.83,59.6 U40.3 | U39.3 68.4,51.37 68.4,52.85 65.7,52.85 C39.1 65.35,52.65 65.5,52.5 v65.5,51.5 | v61.1,59.1 61.1,60.35 C38.1 61.79,60.75 61.83,60.79 63.53,60.79 63.53,59.37 U38.3 | U37.3 91.23,37.43 89.81,37.43 89.81,35.73 89.85,35.69 C37.1 arc-90 89.95,34.6 v91.5,34.6 | v91.1,20.2 C35.1 90.05,21.19 89.91,21.33 89.91,23.07 U35.3 | v91.4,27.3 C36.1 89.95,28.39 89.81,28.53 89.81,30.23 91.23,30.23 U36.3 | U34.3 91.33,15.93 89.91,15.93 89.91,14.23 89.95,14.19 C34.1 v91.4,13.1 | U33.3 85.33,2.97 85.33,4.39 83.63,4.39 83.59,4.35 C33.1 v82.5,2.7 | U45.3 54.77,60.89 53.03,60.89 52.99,60.85 C45.1 51.9,60.75 51.9,58.7 v52.7,57.9 | U32.3 68.19,16.93 68.19,18.94 68.05,18.94 C32.1 v66.5,19.9 | U31.3 68.29,9.63 68.29,11.64 68.15,11.64 C31.1 v66.5,12.6 | U30.3 59.96,8.91 59.96,6.91 59.97,6.91 C30.1 61.4,5.97 v61.43,6 | U29.3 37.57,43.8 37.57,45.8 37.56,45.8 C29.1 36.22,46.74 36.18,46.69 v35.87,46.69 | U28.3 68.4,24.19 68.4,26.45 67.99,26.45 C28.1 67.94,27.06 v66.43,27.06
  Bottom 0.508: U26.3 67.98,31.35 67.98,33.36 C26.1 66.52,34.3 v66.47,34.24 | U25.3 68.05,38.55 68.05,41.37 arc90 C25.1 66.56,41.5 v66.51,41.45 | U24.3 67.92,45.64 C24.1 67.8,48.46 v66.41,48.46 | U21.3 29.57,42.45 29.57,40.71 29.58,40.71 C21.1 29.82,39.14 v30.9,39.14 | U22.3 29.57,49.92 29.57,47.91 29.58,47.91 C22.1 31.05,46.84 v31.1,46.9 | U23.3 89.76,44.78 89.76,42.77 89.77,42.77 C23.1 v91.33,41.84 v91.34,41.83 | U11.3 37.8,36.52 37.8,39.32 37.5,39.32 C11.1 36.29,39.47 v36.29,39.59 | v36.47,53.3 36.8,53.3 C12.1 37.8,53.74 37.8,51.1 37.68,50.98 U12.3 | U13.3 60.02,16.02 60.02,14.02 60.04,14.02 C13.1 60.13,12.97 v61.57,12.97 | U14.3 36.16,29.47 37.59,29.47 37.59,32.24 C14.1 arc-90 37.4,32.31 v35.92,32.31 | U15.3 61.51,30.63 60.06,30.63 60.06,27.71 C15.1 60.46,27.31 61.4,27.31 v61.6,27.11 | U16.3 37.46,22.13 37.46,24.13 37.45,24.13 C16.1 36.05,25.2 v36.05,25.08 | U17.3 60.1,37.95 60.1,35.94 C17.1 61.63,34.88 v61.63,34.77 | U18.3 37.46,15.01 37.46,15.54 37.47,15.54 37.47,17.01 37.46,17.01 C18.1 37.47,18.03 v35.81,18.03 | U19.3 59.93,45.23 59.93,42.08 60.06,42.08 C19.1 60.06,42.11 v61.72,42.11 | U20.3 37.69,7.75 37.69,10.82 C20.1 37.42,10.84 v35.65,10.84 | U2.3 6.55,45.68 7.95,45.68 7.95,47.64 C2.1 6.94,48.7 v6.88,48.76 | U3.3 31,13.45 29.58,13.45 29.58,10.29 C3.1 31.14,10.29 v31.17,10.33 | U4.3 7.9,38.38 7.9,40.38 C4.1 6.31,41.32 v6.29,41.34 | U5.3 29.44,20.67 29.44,17.82 C5.1 31.19,17.6 v31.2,17.59 | U6.3 6.55,31.09 8.29,31.09 8.29,33.78 C6.1 6.37,34.12 v6.34,34.09 | U7.3 31.19,28.09 31.19,25.3 31.39,25.1 C7.1 32.55,24.91 v32.55,24.94 | U8.3 7.79,23.7 7.92,23.83 7.92,25.44 7.88,25.48 C8.1 7.87,26.68 v5.91,26.68
  Bottom 0.508: U9.3 29.68,35.25 29.63,35.3 29.34,35.3 29.34,32.67 C9.1 29.71,32.3 v30.93,32.3 | U10.3 7.81,16.51 7.91,16.61 7.91,18.25 7.89,18.27 C10.1 6.39,19.4 v6.31,19.32 | U27.3 61.47,23.26 59.82,23.26 59.82,20.43 C27.1 61.59,20.23 v61.64,20.27 | v90.1,51.2 C49.1 90.14,52.89 93.01,52.89 93.06,52.84 U49.3 | 2.50 81.39,45 v81.2,45 | 2.47 77.7,43.72 v77.7,43.7 | 2.46 81.22,42.48 v81.2,42.5 | 2.43 v77.79,41.21 v77.8,41.2 | 2.42 81.24,39.94 v81.2,39.9 | 2.39 77.77,38.67 v77.8,38.7 | 2.38 v81.2,37.4 | 2.35 77.73,36.13 v77.8,36.2 | 2.34 81.24,34.86 v81.2,34.9 | 2.31 77.79,33.59 v77.8,33.6 | 2.30 81.28,32.32 v81.2,32.4 | 2.27 77.75,31.05 v77.8,31.1 | 2.26 81.22,29.78 v81.2,29.8 | 2.23 v77.79,28.51 v77.8,28.5 | 2.22 81.24,27.24 v81.2,27.2 | 2.19 77.77,25.97 v77.8,26 | 2.18 v81.2,24.7 | 2.15 v77.7,23.4 | 2.14 81.26,22.16 v81.2,22.1 | v77.8,20.9 77.79,20.89 2.11 | 2.10 81.32,19.62 v81.3,19.6 | 2.7 77.75,18.35 v77.8,18.3 | 2.6 81.32,17.08 v81.3,17.1 | 2.3 v77.79,15.81 v77.8,15.8 | 2.2 81.34,14.54 v81.3,14.5 | 4.10 20.52,19.62 v20.5,19.6 | 4.15 16.92,23.48 v16.9,23.5 | 4.18 v20.5,24.7 | 4.22 20.62,27.28 v20.6,27.3 | 4.23 v16.99,28.51 v17,28.5 | 4.26 19.58,29.78 v19.3,29.5 | 4.27 15.85,31.05 v15.8,31 | 4.30 20.88,32.32 | 4.31 15.81,33.59 | 4.34 20.86,34.86 v20.9,34.9 | 4.35 15.83,36.13 | 4.38 v21,37.4 | 4.39 15.83,38.67 | 4.42 20.66,39.9 v20.9,39.9 | 4.43 v15.71,41.21 | 4.46 20.78,42.48 | 4.47 15.75,43.75 | 4.50 20.9,45.3 v21,45.3 | 4.2 20.58,14.5 v20.5,14.5 | 4.3 v16.9,15.8 | 4.7 16.92,18.32 v16.9,18.3 | 3.19 47.27,25.97 v47.3,26 | 3.11 47.19,20.89 v47.2,20.9 | 4.19 16.92,25.92 v16.9,25.9 | 4.14 20.54,22.16 v20.5,22.2 | 4.6 20.54,17 v20.5,17 | 4.11 v16.91,20.9 v16.9,20.9
  Bottom 0.508: U1.3 15.7,4.27 15.7,5.9 13.07,5.9 C1.1 12.66,5.49 v12.66,3.96
  Bottom 0.61: 15.75,43.75 v15.7,43.7 | v15.71,41.21 v15.7,41.2 | 15.83,38.67 v15.8,38.7 | 15.83,36.13 v15.8,36.1 | 15.81,33.59 v15.8,33.6 | v21,37.4 | 20.78,42.48 v20.8,42.5 | 20.88,32.32 v20.9,32.3
  Bottom 1.016: C55.2 C51.2 23.75,28.75 arc-90 v24,28.5
  Bottom 1.27: UA78M05CDCY.4 UA78M05CDCY.2 v80.1,90.2 79.2,90.2 C54.1 C53.1
  pour $GND: 0,0 0,100 100,100 100,0
  pour $GND (no thermals): 0,100 100,100 100,0 0,0
N$1
  Top 0.305: 91.86,93.15 91.83,93.18 86.66,93.18 85.81,94.03 U1200.9
  Top 0.508: PROTECT_R_1.1 98.42,88.47 97.5,89.4 97,89.9 TP35.TP 95.14,93.15 91.86,93.15
N$2
  Top 0.508: R5.1 77.84,97.93 R4.1 75.7,97.73 74.64,96.67 74.39,96.67 R7.1
N$3
  Top 0.305: U1200.8 85.75,93.37 86.65,92.47 87.3,92.47
  Top 0.508: PROTECT_R_2.1 95.93,87.57 TP36.TP 93.4,88.9 92.61,89.69 92.61,91.23 92.22,91.62 91.37,92.47 87.3,92.47
N$5
  Top 0.203: 44.1,98.03 U$1.39/A3
  Top 0.508: R10.1 62.4,92.65 R11.2 62.35,94 61.8,94 59.4,96.4 48.4,96.4 46.66,98.14 U$1.39/A3 | TP21.TP 44.1,98.03
N$6  (via drill 0.35, 0.5)
  Top 0.305: v83,94.29 83.05,94.29 83.36,94.6 84.24,94.6 U1200.10
  Top 0.508: U$1.38/A3 46.97,94.36 v47.88,94.36
  Bottom 0.508: v47.88,94.36 50.03,92.21 75.8,92.21 77.95,94.36 82.94,94.36 v83,94.29
N$7
  Top 0.508: R10.2 R8.1 67.45,91.99 68.09,92.64 U200.1
N$8  (via drill 0.35)
  Top 0.305: U$1.28 v50.5,82.9
  Bottom 0.305: R_PROTECT.1 arc-90 50.5,85.55
  Bottom 0.406: 50.5,85.55 v50.5,82.9
N$9
  Top 0.203: U$1.3V3_LO3
  Top 0.508: TP1.TP U$1.3V3_LO3
N$10  (via drill 0.35, 0.5)
  Top 0.305: v75.95,95.92 76.01,95.98 U1200.13
  Top 0.508: U$1.37/A3 49.75,98.14 v50.42,98.81
  Bottom 0.508: v75.95,95.92 72.92,98.95 50.56,98.95 v50.42,98.81
N$11  (via drill 0.35, 0.5)
  Top 0.305: v75.43,95.34 75.51,95.26 77,95.26 U1200.14
  Top 0.508: U$1.35/A3 55.26,98.14 v55.46,97.94
  Bottom 0.508: v75.43,95.34 75.33,95.44 57.96,95.44 v55.46,97.94
N$12  (via drill 0.35, 0.5)
  Top 0.305: v82.86,95.18 83,95.32 U1200.11
  Top 0.508: U$1.36/A3 52.93,94.58 v52.96,94.61
  Bottom 0.508: v82.86,95.18 81.87,96.17 78.43,96.17 76.03,93.77 53.81,93.77 v52.96,94.61
N$13
  Top 0.203: TP2.TP 8.64,92.41
  Top 0.508: 8.64,92.41 U$1.23/A3
N$14
  Top 0.508: R8.2 69.36,91.61 U200.2 69.43,93.6 69.43,94.92 69.36,94.98 67.63,94.98 67.34,94.7 67.34,93.67 64.88,93.67 R9.1
N$15
  Top 0.203: 11.09,94.48 U$1.22/A3
  Top 0.508: TP3.TP 11.09,94.48
N$16
  Top 0.203: 13.75,98.11 U$1.21/A3
  Top 0.508: TP4.TP 13.75,98.11
N$17
  Top 0.508: TP5.TP 16.27,94.59
  Top 1.016: 16.27,94.59 U$1.20/A3
N$18
  Top 0.203: 18.76,98.09 U$1.19/A5/SCL3
  Top 0.508: TP6.TP 18.76,98.09
N$19
  Top 0.203: 23.84,98.1 U$1.17/A4
  Top 0.508: TP7.TP 23.84,98.1
N$20
  Top 0.203: 21.26,94.5 U$1.18/A4/SDA3
  Top 0.508: TP8.TP 21.26,94.5
N$21
  Bottom 0.254: NPN_3.1 93.06,85.04 94.57,85.04 95.61,84 96.93,84 | NPN_2.1 96.46,83.27 NPN_1.1
  Bottom 0.305: 96.93,84 NPN_1.1
  Bottom 0.406: R_TO_GND3.2 R_PROTECT3.2 42.2,98.2 49,91.4 69.5,91.4 74.9,86 90.04,86 NPN_3.1 92.03,79.27 NPN_4.1
N$23  (via drill 0.35)
  Top 0.305: v77.07,87.9 U1200.24
  Bottom 0.508: v77.07,87.9 77.07,92.1 78.17,93.2 79.15,93.2 C54.2
  Bottom 1.27: UA78M05CDCY.3 81.3,93.25 C54.2
N$24
  Top 0.508: 5V-REG.IN 15,67.1
  Top 0.813: 15,67.1 14.3,66.4 JP1.1
  Bottom 1.27: 5V-REG.IN 13.89,67.1 J2.1
N$25
  Top 0.203: JP3.1 4.84,89.65 4.63,89.65
  Top 1.016: 4.63,89.65 C56.1
  Top 1.27: U$1.VIN3 1.02,89.73 C52.1 C56.1
N$26
  Bottom 0.254: NPN_6.1 86.36,83.39 NPN_5.1 85.33,83.94 84.38,84.89 82.88,84.89 NPN_7.1 81.15,83.17 NPN_8.1
  Bottom 0.406: R_TO_GND4.2 R_PROTECT4.2 44.4,94.7 48.5,90.6 60.3,90.6 66.8,90.6 72.1,85.3 80.41,85.3 NPN_7.1
N$27
  Top 0.203: 34.11,98.07 U$1.13/SCK3
  Top 0.508: TP12.TP 34.11,98.07
N$28
  Top 0.203: TP13.TP 36.58,92.42
  Top 0.508: 36.58,92.42 U$1.GND7
N$29
  Top 0.203: 39.1,98.11 U$1.A22/DAC1
  Top 0.508: TP14.TP 39.1,98.11
N$30
  Top 0.203: 41.6,94.52 U$1.A21/DAC0
  Top 0.508: TP15.TP 41.6,94.52
N$31
  Top 1.016: U$1.3V4 36.58,85.22 TP16.TP
N$32
  Top 0.305: U200.3 70.64,94.9 72.48,94.9 73.47,93.9 R7.2 73.58,93.9 74.8,95.12 74.8,95.67 75.73,96.6 81.4,96.6
  Top 0.406: 83.05,89.08 arc90 83.31,88.82 U1200.1
  Top 0.508: 83.05,89.08 83.05,92.05 81.4,93.7 81.4,96.6 TP37.TP
N$33
  Top 0.203: 3.6,98.1 U$1.AGND3
  Top 0.508: TP17.TP 3.6,98.1
N$35
  Top 0.305: U1200.7 85.66,92.73 88.43,89.96 88.43,89.43 89.85,88 91.6,88 PROTECT_R_3.1
N$36
  Bottom 0.254: NPN_16.1 61.5,79.09 NPN_15.1 61.73,83.6 62.77,84.63 64.04,84.63 65.07,83.6 66.59,83.6 | 66.59,83.6 NPN_13.1 | NPN_14.1 65.9,82.91 66.59,83.6
  Bottom 0.305: R_PROTECT.2 arc-90 52,86.05
  Bottom 0.406: 52,86.05 R_TO_GND.2 56.55,83.6 NPN_15.1
N$37
  Bottom 0.254: NPN_10.1 76.16,83.26 NPN_9.1 75.35,83.78 74.37,84.75 72.86,84.75 NPN_11.1 71.12,83.01 NPN_12.1
  Bottom 0.406: R_PROTECT2.2 R_TO_GND2.2 29.45,89.7 57.2,89.7 61.1,85.8 69.75,85.8 NPN_11.1
N$38
  Top 0.305: U1200.6 85,92.07 85.5,92.07 86.28,91.28 | 86.28,91.28 87.08,90.48 | PROTECT_R_4.1 90.93,86.64 90.4,87.17 88.53,87.17 87.61,88.09 87.61,89.96 87.08,90.48 | 86.28,91.28 | 87.08,90.48
N$65
  Top 0.305: U1200.5 85.42,91.44 86.53,90.33 | 86.53,90.33 | 86.53,90.33 87.1,89.75 87.1,87.5 PROTECT_R_5.1
N$68